# EAGLE design Swarmy_INS_Flight_Controller (EAGLE 9.6.2)
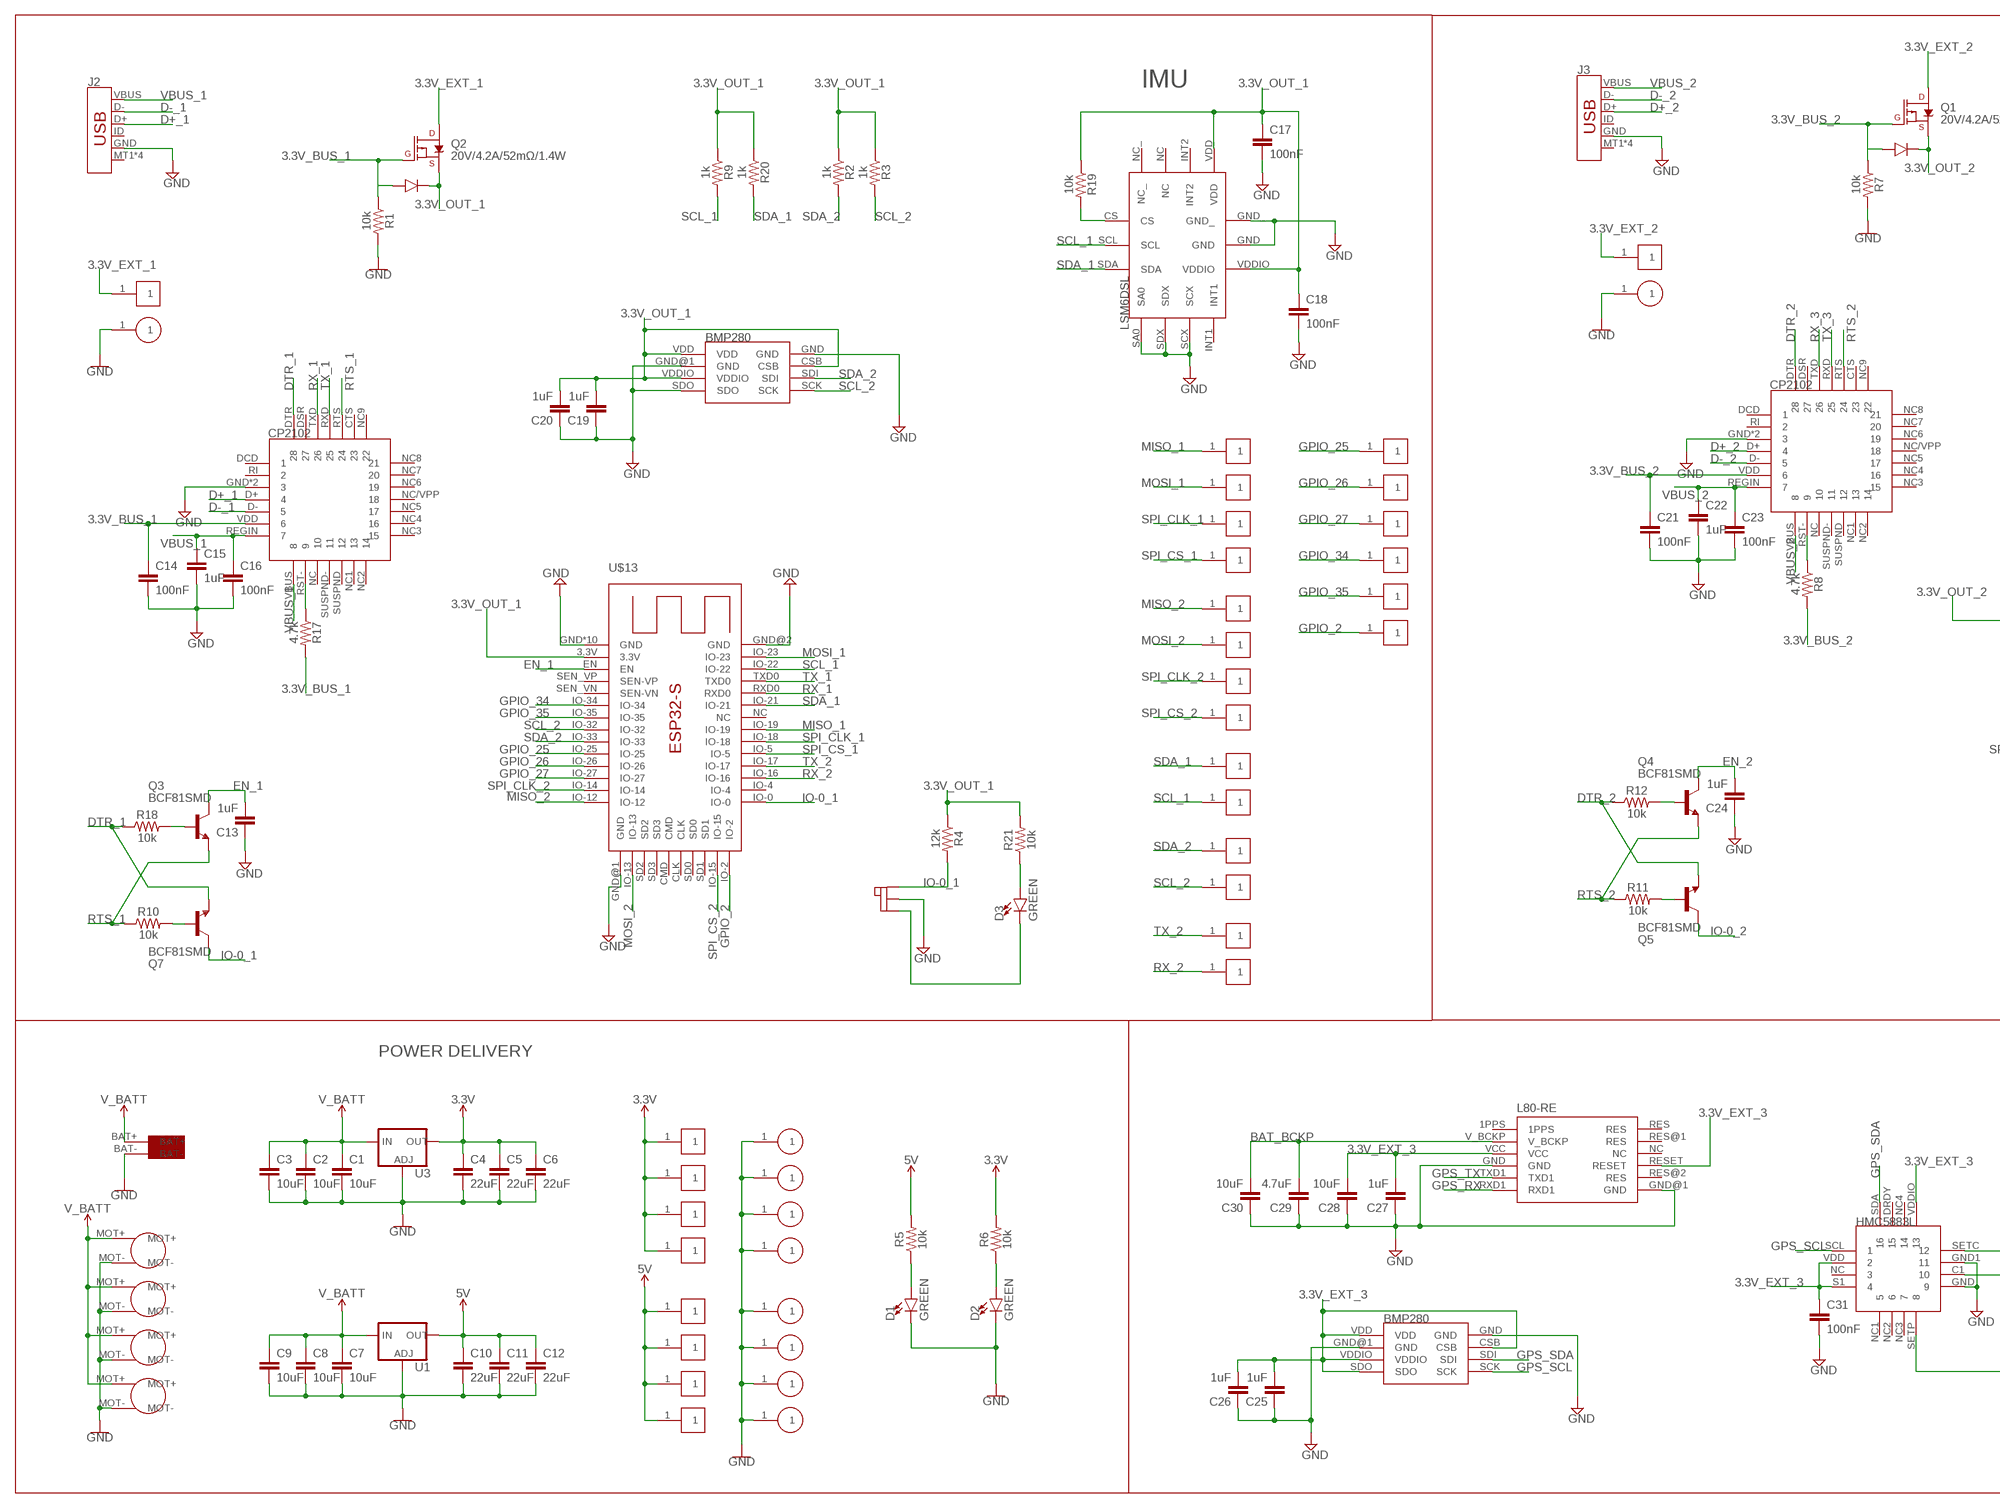
[diagram p0: schematic, sheet 1, part 1 of 2]
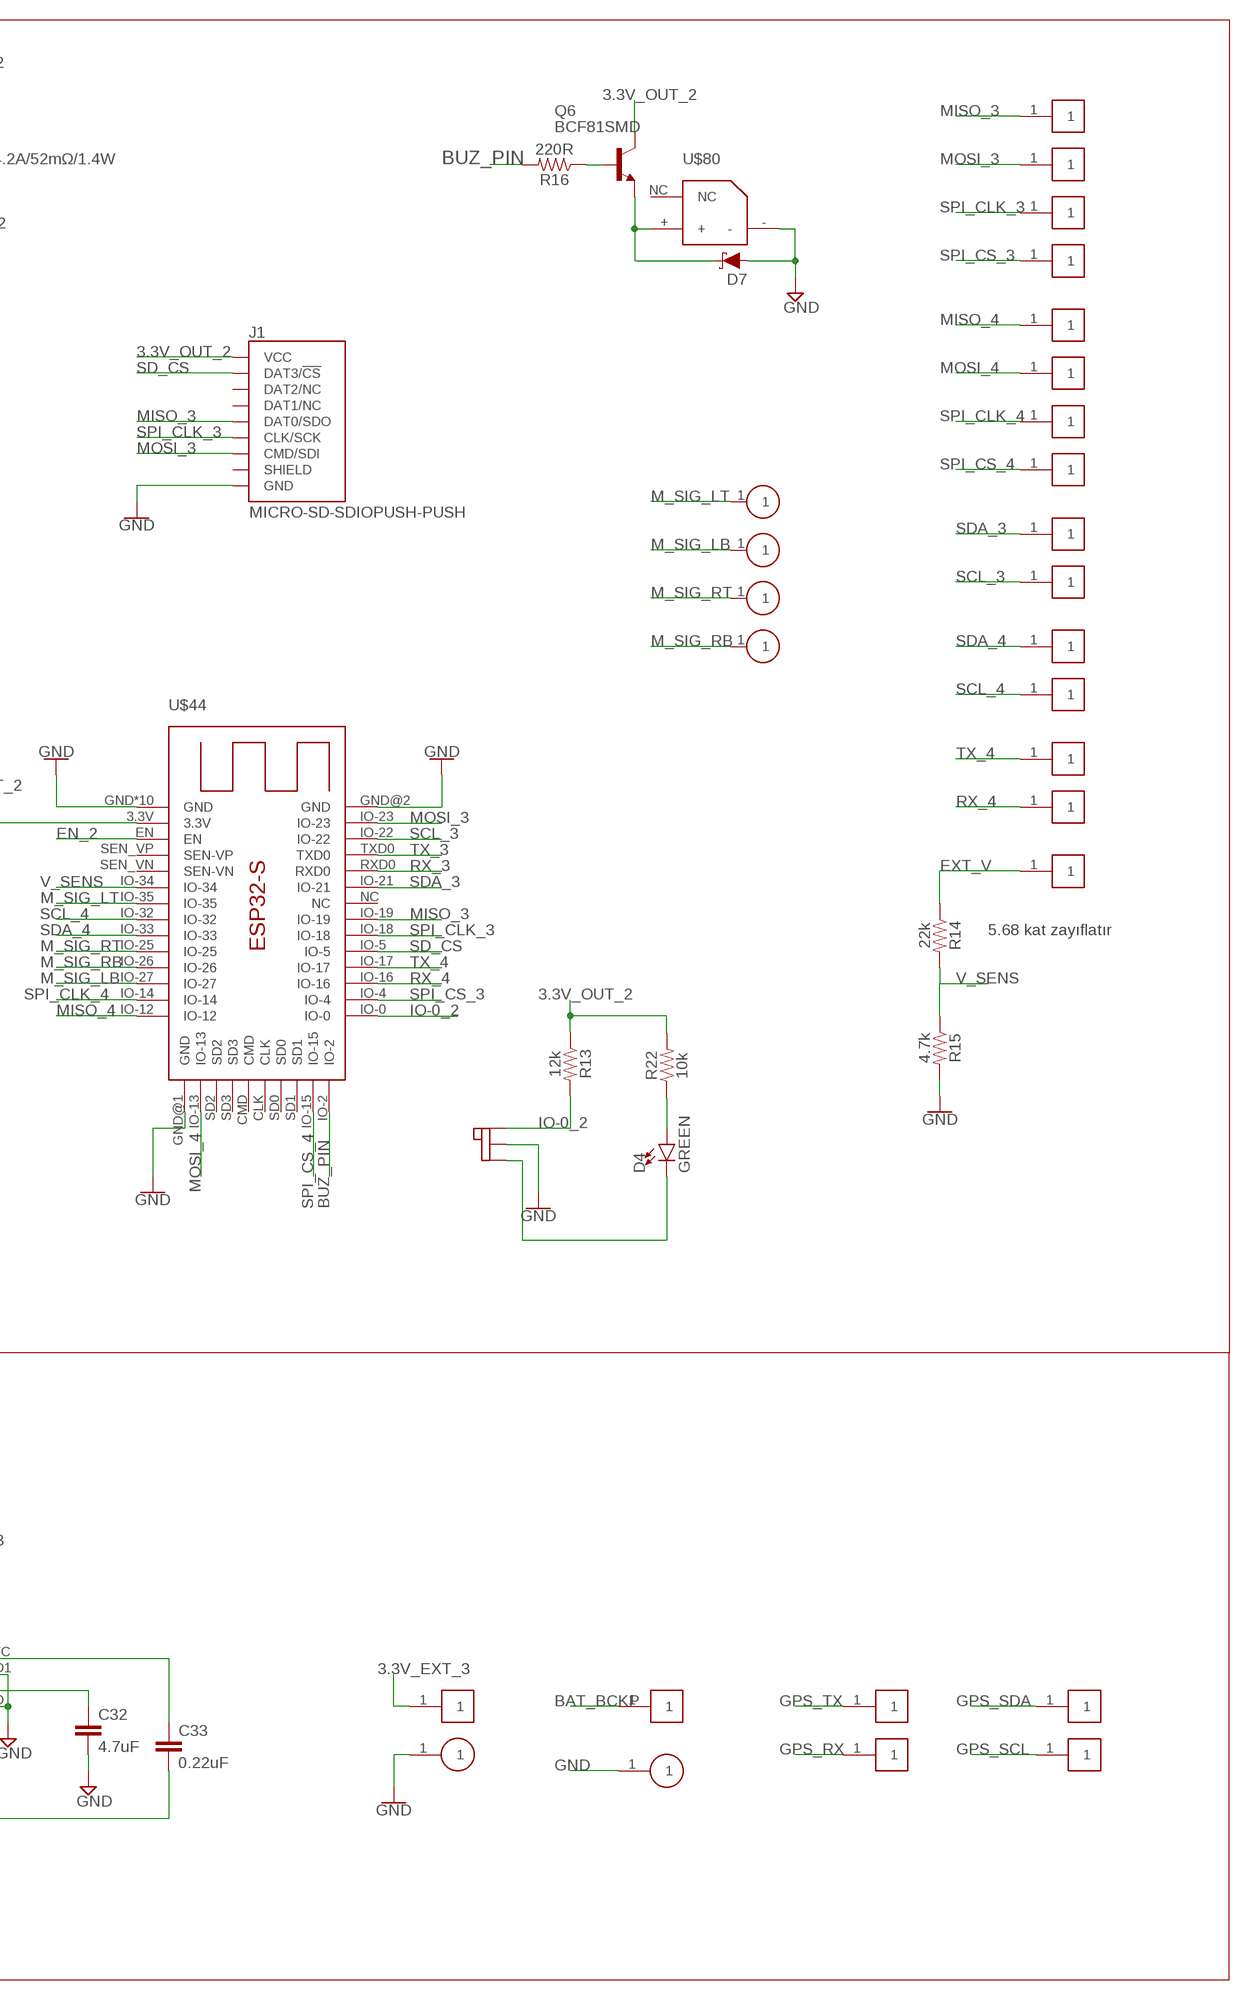
[diagram p1: schematic, sheet 1, part 2 of 2]

## Parts
C1  10uF  1.0PF-0603-50V-25%  [0603]
C2  10uF  1.0PF-0603-50V-25%  [0603]
C3  10uF  1.0PF-0603-50V-25%  [0603]
C4  22uF  1.0PF-0603-50V-25%  [0603]
C5  22uF  1.0PF-0603-50V-25%  [0603]
C6  22uF  1.0PF-0603-50V-25%  [0603]
C7  10uF  1.0PF-0603-50V-25%  [0603]
C8  10uF  1.0PF-0603-50V-25%  [0603]
C9  10uF  1.0PF-0603-50V-25%  [0603]
C10  22uF  1.0PF-0603-50V-25%  [0603]
C11  22uF  1.0PF-0603-50V-25%  [0603]
C12  22uF  1.0PF-0603-50V-25%  [0603]
C13  1uF  2.2UF-0603-10V-20%  [0603]
C14  100nF  2.2UF-0603-10V-20%  [0603]
C15  1uF  2.2UF-0603-10V-20%  [0603]
C16  100nF  2.2UF-0603-10V-20%  [0603]
C17  100nF  2.2UF-0603-10V-20%  [0603]
C18  100nF  2.2UF-0603-10V-20%  [0603]
C19  1uF  2.2UF-0603-10V-20%  [0603]
C20  1uF  2.2UF-0603-10V-20%  [0603]
C21  100nF  2.2UF-0603-10V-20%  [0603]
C22  1uF  2.2UF-0603-10V-20%  [0603]
C23  100nF  2.2UF-0603-10V-20%  [0603]
C24  1uF  2.2UF-0603-10V-20%  [0603]
C25  1uF  2.2UF-0603-10V-20%  [0603]
C26  1uF  2.2UF-0603-10V-20%  [0603]
C27  1uF  2.2UF-0603-10V-20%  [0603]
C28  10uF  2.2UF-0603-10V-20%  [0603]
C29  4.7uF  2.2UF-0603-10V-20%  [0603]
C30  10uF  2.2UF-0603-10V-20%  [0603]
C31  100nF  2.2UF-0603-10V-20%  [0603]
C32  4.7uF  2.2UF-0603-10V-20%  [0603]
C33  0.22uF  2.2UF-0603-10V-20%  [0603]
D1  GREEN  LED-GREEN0603  [LED-0603]
D2  GREEN  LED-GREEN0603  [LED-0603]
D3  GREEN  LED-GREEN0603  [LED-0603]
D4  GREEN  LED-GREEN0603  [LED-0603]
D7  120mA/40V/370mV  DIODE-SCHOTTKY-RB751S40  [SOD-523]
J1  MICRO-SD-SDIOPUSH-PUSH  [MICRO-SD-SOCKET]
J2  USB_MICRO-B_SMT  [USB-MICROB]
J3  USB_MICRO-B_SMT  [USB-MICROB]
Q1  20V/4.2A/52mΩ/1.4W  MOSFET_PCH-DMG2305UX-7  [SOT23-3]
Q2  20V/4.2A/52mΩ/1.4W  MOSFET_PCH-DMG2305UX-7  [SOT23-3]
Q3  BCF81SMD  [SOT23-BEC]
Q4  BCF81SMD  [SOT23-BEC]
Q5  BCF81SMD  [SOT23-BEC]
Q6  BCF81SMD  [SOT23-BEC]
Q7  BCF81SMD  [SOT23-BEC]
R1  10k  12KOHM-0603-1/10W-1%  [0603]
R2  1k  12KOHM-0603-1/10W-1%  [0603]
R3  1k  12KOHM-0603-1/10W-1%  [0603]
R4  12k  12KOHM-0603-1/10W-1%  [0603]
R5  10k  12KOHM-0603-1/10W-1%  [0603]
R6  10k  12KOHM-0603-1/10W-1%  [0603]
R7  10k  12KOHM-0603-1/10W-1%  [0603]
R8  4.7k  12KOHM-0603-1/10W-1%  [0603]
R9  1k  12KOHM-0603-1/10W-1%  [0603]
R10  10k  12KOHM-0603-1/10W-1%  [0603]
R11  10k  12KOHM-0603-1/10W-1%  [0603]
R12  10k  12KOHM-0603-1/10W-1%  [0603]
R13  12k  12KOHM-0603-1/10W-1%  [0603]
R14  22k  12KOHM-0603-1/10W-1%  [0603]
R15  4.7k  12KOHM-0603-1/10W-1%  [0603]
R16  220R  12KOHM-0603-1/10W-1%  [0603]
R17  4.7k  12KOHM-0603-1/10W-1%  [0603]
R18  10k  12KOHM-0603-1/10W-1%  [0603]
R19  10k  12KOHM-0603-1/10W-1%  [0603]
R20  1k  12KOHM-0603-1/10W-1%  [0603]
R21  10k  12KOHM-0603-1/10W-1%  [0603]
R22  10k  12KOHM-0603-1/10W-1%  [0603]
U1  V_REG_LM1117SOT223  [SOT223]
U3  V_REG_LM1117SOT223  [SOT223]
U$1  6X5MM_BATTERY_SOLDER_PADS  [6X5MM_BATTERY_SOLDER_PADS]
U$2  3X4.5MM_MOTOR_SOLDER_PADS  [3X4.5MM_MOTOR_SOLDER_PADS]
U$3  3X4.5MM_MOTOR_SOLDER_PADS  [3X4.5MM_MOTOR_SOLDER_PADS]
U$4  3X4.5MM_MOTOR_SOLDER_PADS  [3X4.5MM_MOTOR_SOLDER_PADS]
U$5  3X4.5MM_MOTOR_SOLDER_PADS  [3X4.5MM_MOTOR_SOLDER_PADS]
U$6  2X2MM_SQUARE_PAD  [2X2MM_SQUARE_PAD]
U$7  2X2MM_SQUARE_PAD  [2X2MM_SQUARE_PAD]
U$8  2X2MM_SQUARE_PAD  [2X2MM_SQUARE_PAD]
U$9  2X2MM_SQUARE_PAD  [2X2MM_SQUARE_PAD]
U$10  2X2MM_SQUARE_PAD  [2X2MM_SQUARE_PAD]
U$11  2X2MM_SQUARE_PAD  [2X2MM_SQUARE_PAD]
U$12  2X2MM_SQUARE_PAD  [2X2MM_SQUARE_PAD]
U$13  ESP32-S  [ESP32-S]
U$14  2X2MM_PAD  [2X2MM_PAD]
U$15  2X2MM_PAD  [2X2MM_PAD]
U$16  2X2MM_PAD  [2X2MM_PAD]
U$17  2X2MM_PAD  [2X2MM_PAD]
U$18  2X2MM_PAD  [2X2MM_PAD]
U$19  2X2MM_PAD  [2X2MM_PAD]
U$20  2X2MM_PAD  [2X2MM_PAD]
U$21  2X2MM_PAD  [2X2MM_PAD]
U$22  2X2MM_SQUARE_PAD  [2X2MM_SQUARE_PAD]
U$23  2X2MM_SQUARE_PAD  [2X2MM_SQUARE_PAD]
U$24  2X2MM_PAD  [2X2MM_PAD]
U$25  SOD_123_DIODE  [SOD_23_DIODE]
U$26  LSM6DSL_6DOF  [LSM6DSL_6DOF]
U$27  BMP280  [BMP280]
U$28  CP2102_SERIAL_TTL  [CP2102_SERIAL_TTL]
U$29  2X2MM_SQUARE_PAD  [2X2MM_SQUARE_PAD]
U$30  2X2MM_SQUARE_PAD  [2X2MM_SQUARE_PAD]
U$31  2X2MM_SQUARE_PAD  [2X2MM_SQUARE_PAD]
U$32  2X2MM_SQUARE_PAD  [2X2MM_SQUARE_PAD]
U$33  2X2MM_SQUARE_PAD  [2X2MM_SQUARE_PAD]
U$34  2X2MM_SQUARE_PAD  [2X2MM_SQUARE_PAD]
U$35  2X2MM_SQUARE_PAD  [2X2MM_SQUARE_PAD]
U$36  2X2MM_SQUARE_PAD  [2X2MM_SQUARE_PAD]
U$37  2X2MM_SQUARE_PAD  [2X2MM_SQUARE_PAD]
U$38  2X2MM_SQUARE_PAD  [2X2MM_SQUARE_PAD]
U$39  2X2MM_SQUARE_PAD  [2X2MM_SQUARE_PAD]
U$40  2X2MM_SQUARE_PAD  [2X2MM_SQUARE_PAD]
U$41  2X2MM_SQUARE_PAD  [2X2MM_SQUARE_PAD]
U$42  2X2MM_SQUARE_PAD  [2X2MM_SQUARE_PAD]
U$43  SMD_SLIDE_SWITCH  [SMD_SLIDE_SWITCH]
U$44  ESP32-S  [ESP32-S]
U$45  2X2MM_SQUARE_PAD  [2X2MM_SQUARE_PAD]
U$46  2X2MM_PAD  [2X2MM_PAD]
U$47  SOD_123_DIODE  [SOD_23_DIODE]
U$48  CP2102_SERIAL_TTL  [CP2102_SERIAL_TTL]
U$49  SMD_SLIDE_SWITCH  [SMD_SLIDE_SWITCH]
U$50  2X2MM_SQUARE_PAD  [2X2MM_SQUARE_PAD]
U$51  2X2MM_SQUARE_PAD  [2X2MM_SQUARE_PAD]
U$52  2X2MM_SQUARE_PAD  [2X2MM_SQUARE_PAD]
U$53  2X2MM_SQUARE_PAD  [2X2MM_SQUARE_PAD]
U$54  2X2MM_SQUARE_PAD  [2X2MM_SQUARE_PAD]
U$55  2X2MM_SQUARE_PAD  [2X2MM_SQUARE_PAD]
U$56  2X2MM_SQUARE_PAD  [2X2MM_SQUARE_PAD]
U$57  2X2MM_SQUARE_PAD  [2X2MM_SQUARE_PAD]
U$58  2X2MM_SQUARE_PAD  [2X2MM_SQUARE_PAD]
U$59  2X2MM_SQUARE_PAD  [2X2MM_SQUARE_PAD]
U$60  2X2MM_SQUARE_PAD  [2X2MM_SQUARE_PAD]
U$61  2X2MM_SQUARE_PAD  [2X2MM_SQUARE_PAD]
U$62  2X2MM_SQUARE_PAD  [2X2MM_SQUARE_PAD]
U$63  2X2MM_SQUARE_PAD  [2X2MM_SQUARE_PAD]
U$64  L80-RE-M37  [L80-RE-M37]
U$65  2X2MM_SQUARE_PAD  [2X2MM_SQUARE_PAD]
U$66  BMP280  [BMP280]
U$67  2X2MM_SQUARE_PAD  [2X2MM_SQUARE_PAD]
U$68  2X2MM_PAD  [2X2MM_PAD]
U$69  2X2MM_SQUARE_PAD  [2X2MM_SQUARE_PAD]
U$70  2X2MM_PAD  [2X2MM_PAD]
U$71  2X2MM_SQUARE_PAD  [2X2MM_SQUARE_PAD]
U$72  2X2MM_SQUARE_PAD  [2X2MM_SQUARE_PAD]
U$73  2X2MM_SQUARE_PAD  [2X2MM_SQUARE_PAD]
U$74  2X2MM_SQUARE_PAD  [2X2MM_SQUARE_PAD]
U$75  HMC5883L  [HMC5883L]
U$76  2X2MM_ROUND_PAD  [2X2MM_ROUND_PAD]
U$77  2X2MM_ROUND_PAD  [2X2MM_ROUND_PAD]
U$78  2X2MM_ROUND_PAD  [2X2MM_ROUND_PAD]
U$79  2X2MM_ROUND_PAD  [2X2MM_ROUND_PAD]
U$80  PASIVE_BUZZER_5MM_X_5MM_20MM  [PASIVE_BUZZER_5MM_X_5MM_20MM]
U$81  2X2MM_SQUARE_PAD  [2X2MM_SQUARE_PAD]
U$82  2X2MM_SQUARE_PAD  [2X2MM_SQUARE_PAD]
U$83  2X2MM_SQUARE_PAD  [2X2MM_SQUARE_PAD]
U$84  2X2MM_SQUARE_PAD  [2X2MM_SQUARE_PAD]
U$85  2X2MM_SQUARE_PAD  [2X2MM_SQUARE_PAD]
U$86  2X2MM_SQUARE_PAD  [2X2MM_SQUARE_PAD]

## Nets
3.3V: C4.1 C5.1 C6.1 R6.2 U3.2(OUT) U3.4(OUT) U$6.1 U$7.1 U$8.1 U$22.1
3.3V_BUS_1: C14.1 Q2.1(G) R1.1 R17.2 U$25.A U$28.VDD
3.3V_BUS_2: C21.1 Q1.1(G) R7.1 R8.2 U$47.A U$48.VDD
3.3V_EXT_1: Q2.3(D) U$23.1
3.3V_EXT_2: Q1.3(D) U$45.1
3.3V_EXT_3: C25.2 C26.2 C27.2 C28.2 C31.1 U$64.RESET U$64.VCC U$66.CSB U$66.SDO U$66.VDD U$66.VDDIO U$67.1 U$75.S1 U$75.VDD U$75.VDDIO
3.3V_OUT_1: C17.1 C18.1 C19.2 C20.2 Q2.2(S) R2.1 R3.1 R4.1 R9.1 R19.1 R20.1 R21.2 U$13.3.3V U$25.K U$26.VDD U$26.VDDIO U$27.CSB U$27.VDD U$27.VDDIO
3.3V_OUT_2: J1.VCC Q1.2(S) Q6.C R13.1 R22.2 U$44.3.3V U$47.K
5V: C10.1 C11.1 C12.1 R5.2 U1.2(OUT) U1.4(OUT) U$9.1 U$10.1 U$11.1 U$12.1
BAT_BCKP: C29.2 C30.2 U$64.V_BCKP U$69.1
BUZ_PIN: R16.2 U$44.IO-2
D+_1: J2.D+ U$28.D+
D+_2: J3.D+ U$48.D+
D-_1: J2.D- U$28.D-
D-_2: J3.D- U$48.D-
DTR_1: Q7.E R18.1 U$28.DTR
DTR_2: Q5.E R12.1 U$48.DTR
EN_1: C13.2 Q3.C U$13.EN
EN_2: C24.2 Q4.C U$44.EN
EXT_V: R14.1 U$65.1
GND: C1.2 C2.2 C3.2 C4.2 C5.2 C6.2 C7.2 C8.2 C9.2 C10.2 C11.2 C12.2 C13.1 C14.2 C15.2 C16.2 C17.2 C18.2 C19.1 C20.1 C21.2 C22.2 C23.2 C24.1 C25.1 C26.1 C27.1 C28.1 C29.1 C30.1 C31.2 C32.2 D1.C D2.C D7.A J1.GND J1.GND1(GND) J1.GND3(GND) J2.GND J3.GND R1.2 R7.2 R15.2 U1.1(ADJ) U3.1(ADJ) U$1.BAT- U$2.MOT- U$3.MOT- U$4.MOT- U$5.MOT- U$13.GND U$13.GND@1(GND) U$13.GND@2(GND) U$13.GND@3(GND) U$13.GND@4(GND) U$13.GND@5(GND) U$13.GND@6(GND) U$13.GND@7(GND) U$13.GND@8(GND) U$13.GND@9(GND) U$13.GND@10(GND) U$13.GND@11(GND) U$14.1 U$15.1 U$16.1 U$17.1 U$18.1 U$19.1 U$20.1 U$21.1 U$24.1 U$26.GND U$26.GND_ U$26.SA0 U$26.SCX U$26.SDX U$27.GND U$27.GND@1(GND) U$27.SDO U$28.GND U$28.GND1 U$43.2 U$44.GND U$44.GND@1(GND) U$44.GND@2(GND) U$44.GND@3(GND) U$44.GND@4(GND) U$44.GND@5(GND) U$44.GND@6(GND) U$44.GND@7(GND) U$44.GND@8(GND) U$44.GND@9(GND) U$44.GND@10(GND) U$44.GND@11(GND) U$46.1 U$48.GND U$48.GND1 U$49.2 U$64.GND U$64.GND@1(GND) U$66.GND U$66.GND@1(GND) U$68.1 U$70.1 U$75.GND U$75.GND1 U$80.-
GPIO_2: U$13.IO-2 U$86.1
GPIO_25: U$13.IO-25 U$81.1
GPIO_26: U$13.IO-26 U$82.1
GPIO_27: U$13.IO-27 U$83.1
GPIO_34: U$13.IO-34 U$84.1
GPIO_35: U$13.IO-35 U$85.1
GPS_RX: U$64.RXD1 U$72.1
GPS_SCL: U$66.SCK U$74.1 U$75.SCL
GPS_SDA: U$66.SDI U$73.1 U$75.SDA
GPS_TX: U$64.TXD1 U$71.1
IO-0_1: Q7.C R4.2 U$13.IO-0 U$43.3
IO-0_2: Q5.C R13.2 U$44.IO-0 U$49.3
M_SIG_LB: U$44.IO-27 U$77.1
M_SIG_LT: U$44.IO-35 U$76.1
M_SIG_RB: U$44.IO-26 U$79.1
M_SIG_RT: U$44.IO-25 U$78.1
MISO_1: U$13.IO-19 U$29.1
MISO_2: U$13.IO-12 U$33.1
MISO_3: J1.DO/DAT0(DAT0/SDO) U$44.IO-19 U$50.1
MISO_4: U$44.IO-12 U$54.1
MOSI_1: U$13.IO-23 U$30.1
MOSI_2: U$13.IO-13 U$34.1
MOSI_3: J1.DI/CMD(CMD/SDI) U$44.IO-23 U$51.1
MOSI_4: U$44.IO-13 U$55.1
N$1: D1.A R5.1
N$2: D2.A R6.1
N$3: R8.1 U$48.RST-
N$4: Q5.B R11.2
N$5: Q4.B R12.2
N$6: D3.A R21.1
N$7: D4.A R22.1
N$8: D3.C U$43.1
N$9: D4.C U$49.1
N$10: Q6.B R16.1
N$11: R17.1 U$28.RST-
N$12: D7.C Q6.E U$80.+
N$13: Q3.B R18.2
N$15: R19.2 U$26.CS
N$17: Q7.B R10.2
N$22: C33.2 U$75.SETP
N$26: C32.1 U$75.C1
N$27: C33.1 U$75.SETC
RTS_1: Q3.E R10.1 U$28.RTS
RTS_2: Q4.E R11.1 U$48.RTS
RX_1: U$13.RXD0 U$28.TXD
RX_2: U$13.IO-16 U$42.1
RX_3: U$44.RXD0 U$48.TXD
RX_4: U$44.IO-16 U$63.1
SCL_1: R9.2 U$13.IO-22 U$26.SCL U$38.1
SCL_2: R3.2 U$13.IO-32 U$27.SCK U$40.1
SCL_3: U$44.IO-22 U$59.1
SCL_4: U$44.IO-32 U$61.1
SD_CS: J1.CS/DAT3(DAT3/!CS!) U$44.IO-5
SDA_1: R20.2 U$13.IO-21 U$26.SDA U$37.1
SDA_2: R2.2 U$13.IO-33 U$27.SDI U$39.1
SDA_3: U$44.IO-21 U$58.1
SDA_4: U$44.IO-33 U$60.1
SPI_CLK_1: U$13.IO-18 U$31.1
SPI_CLK_2: U$13.IO-14 U$35.1
SPI_CLK_3: J1.SCLK(CLK/SCK) U$44.IO-18 U$52.1
SPI_CLK_4: U$44.IO-14 U$56.1
SPI_CS_1: U$13.IO-5 U$32.1
SPI_CS_2: U$13.IO-15 U$36.1
SPI_CS_3: U$44.IO-4 U$53.1
SPI_CS_4: U$44.IO-15 U$57.1
TX_1: U$13.TXD0 U$28.RXD
TX_2: U$13.IO-17 U$41.1
TX_3: U$44.TXD0 U$48.RXD
TX_4: U$44.IO-17 U$62.1
V_BATT: C1.1 C2.1 C3.1 C7.1 C8.1 C9.1 U1.3(IN) U3.3(IN) U$1.BAT+ U$2.MOT+ U$3.MOT+ U$4.MOT+ U$5.MOT+
V_SENS: R14.2 R15.1 U$44.IO-34
VBUS_1: C15.1 C16.1 J2.VBUS U$28.REGIN U$28.VBUS
VBUS_2: C22.1 C23.1 J3.VBUS U$48.REGIN U$48.VBUS
Unconnected: J1.CD1(SHIELD) J1.DAT1(DAT1/NC) J1.DAT2(DAT2/NC) J2.ID J2.MT1(SHIELD) J2.MT2(SHIELD) J2.P$1(SHIELD) J2.P$2(SHIELD) J3.ID J3.MT1(SHIELD) J3.MT2(SHIELD) J3.P$1(SHIELD) J3.P$2(SHIELD) U$13.CLK U$13.CMD U$13.IO-4 U$13.NC U$13.SD0 U$13.SD1 U$13.SD2 U$13.SD3 U$13.SEN_VN(SEN-VN) U$13.SEN_VP(SEN-VP) U$26.INT1 U$26.INT2 U$26.NC U$26.NC_ U$28.CTS U$28.DCD U$28.DSR U$28.NC U$28.NC1 U$28.NC2 U$28.NC3 U$28.NC4 U$28.NC5 U$28.NC6 U$28.NC7 U$28.NC8 U$28.NC9 U$28.NC/VPP U$28.RI U$28.SUSPND U$28.SUSPND- U$44.CLK U$44.CMD U$44.NC U$44.SD0 U$44.SD1 U$44.SD2 U$44.SD3 U$44.SEN_VN(SEN-VN) U$44.SEN_VP(SEN-VP) U$48.CTS U$48.DCD U$48.DSR U$48.NC U$48.NC1 U$48.NC2 U$48.NC3 U$48.NC4 U$48.NC5 U$48.NC6 U$48.NC7 U$48.NC8 U$48.NC9 U$48.NC/VPP U$48.RI U$48.SUSPND U$48.SUSPND- U$64.1PPS U$64.NC U$64.RES U$64.RES@1(RES) U$64.RES@2(RES) U$75.DRDY U$75.NC U$75.NC1 U$75.NC2 U$75.NC3 U$75.NC4 U$80.NC

## Notes on the sheet
- IMU
- 5.68 kat zayıflatır
- POWER DELIVERY

## Library data of the parts
C1-C12 = SparkFun-Capacitors:1.0PF: 1pF ceramic capacitors A capacitor is a passive two-terminal electrical component used to store electrical energy temporarily in an electric field.; PROD_ID: CAP-07879; VALUE: 1.0pF
C13-C33 = SparkFun-Capacitors:2.2UF: 2.2µF ceramic capacitors A capacitor is a passive two-terminal electrical component used to store electrical energy temporarily in an electric field.; PROD_ID: CAP-07888; VALUE: 2.2uF
D1-D4 = SparkFun-LED:LED-GREEN: Green SMD LED Used in manufacturing of various products at SparkFun Packages: 0603 - SMD 0603 package [Product Link] <http://www.futureelectronics.com/en/technologies/semiconductors/optoelectronics/leds/Pages/9894312-LTST-C190GKT.aspx?CrossPart=HSMG-C190&IM=0> LilyPad 1206 - SMD1206 LilyPad package [Product Link] <http://www.futureelectronics.com/en/Technologies/Product.aspx?ProductID=IN150NGHARVATEKCORPORATION2049943&IM=0> 1206 - SMD1206 package [Product Link] <http://www.futureelectronics.com/en/technologies/semiconductors/optoelectronics/leds/Pages/8315665-LTST-C150KGKT.aspx?IM=0> 1206 Bottom Mount -SMD 1206 Bottom Mount [Product Link] <http://www.digikey.com/product-detail/en/lite-on-inc/LTST-C230KGKT/160-1456-1-ND/386854> SparkFun Products: Pro Mini 328 -5V <https://www.sparkfun.com/products/821> RedBoard <https://www.sparkfun.com/products/12757> MP3 Trigger <https://www.sparkfun.com/products/13720> Makey Makey <https://www.sparkfun.com/products/11076>; PROD_ID: DIO-00821
D7 = SparkFun-DiscreteSemi:DIODE-SCHOTTKY: Schottky diode A Schottky diode is a semiconductor diode which has a low forward voltage drop and a very fast switching action.; PROD_ID: DIO-11018
J1 = SparkFun-Connectors:MICRO-SD-SDIO: microSD Socket for Transflash Push-push type µSD socket. tDoc lines correctly indicate media card edge positions when inserting (unlocked, locked, depressed). NOTE: CD1 and CD2 are connected internally, and the default detect state of the socket is detect pin to ground. SparkFun Products: WAV Trigger <https://www.sparkfun.com/products/13660> CAN-Bus Shield <https://www.sparkfun.com/products/13262> SparkFun Level Shifing microSD Breakout <https://www.sparkfun.com/products/13743>; PROD_ID: CONN-07820
J2 J3 = SparkFun-Connectors:USB_MICRO-B: USB Type Micro-B Connector Male/female and PTH/SMT variants SparkFun Products: SparkFun microB USB Breakout <https://www.sparkfun.com/products/12035> SparkFun USB microB Plug Breakout <https://www.sparkfun.com/products/10031> SparkFun ESP8266 Thing <https://www.sparkfun.com/products/13231>; PROD_ID: CONN-09505; SF_ID: PRT-08533
Q1 Q2 = SparkFun-DiscreteSemi:MOSFET_PCH: P-channel MOSFETs Voltage controlled devices that allow control of high current outputs. SparkFun Products: SparkFun ESP32 Thing <https://www.sparkfun.com/products/13907> SparkFun ESP8266 Thing <https://www.sparkfun.com/products/13231> SparkFun Pi Servo HAT V2 <https://www.sparkfun.com/products/15316> DMG2305UX-7 (20V/4.2A/SOT23-3); PROD_ID: TRAN-14388
Q3-Q7 = transistor-npn:BCF81*: NPN Transistor
R1-R3 R5-R12 R14-R22 = SparkFun-Resistors:12KOHM: 12kΩ resistor A resistor is a passive two-terminal electrical component that implements electrical resistance as a circuit element. Resistors act to reduce current flow, and, at the same time, act to lower voltage levels within circuits. - Wikipedia; PROD_ID: RES-10327; VALUE: 12k
R4 R13 = SparkFun-Resistors:12KOHM: 12kΩ resistor A resistor is a passive two-terminal electrical component that implements electrical resistance as a circuit element. Resistors act to reduce current flow, and, at the same time, act to lower voltage levels within circuits. - Wikipedia; PROD_ID: RES-10327
U1 U3 = SparkFun-IC-Power:V_REG_LM1117: Voltage Regulator LM1117 Standard adjustable voltage regulator but in SMD form. Spark Fun Electronics SKU : COM-00595; PROD_ID: VREG-08170
U$1 = 6x5mm_Battery_Solder_pads:6X5MM_BATTERY_SOLDER_PADS
U$2-U$5 = 3x4.5mm_Motor_solder_pads:3X4.5MM_MOTOR_SOLDER_PADS
U$6-U$12 U$22 U$23 U$45 U$67 U$69 = 2x2mm_square_pad:2X2MM_SQUARE_PAD
U$13 U$44 = ESP32-S:ESP32-S: ESP32-S WIFI/BLUETOOTH MICRO CONTROLLER IC size 18mm x 25.5mm pad size 1.5mm x 0.9mm
U$14-U$21 U$24 U$46 U$68 U$70 = 2x2mm_pad:2X2MM_PAD
U$25 U$47 = SOD_123_Diode:SOD_123_DIODE
U$26 = LSM6DLS:LSM6DSL_6DOF
U$27 U$66 = BMP280_Chip:BMP280
U$28 U$48 = CP2102_SERIAL_TTLlbr:CP2102_SERIAL_TTL
U$29-U$42 U$50-U$63 U$65 U$71-U$74 U$81-U$86 = 2x2mm_square_pad_SM:2X2MM_SQUARE_PAD
U$43 U$49 = SMD_Slide_Switch:SMD_SLIDE_SWITCH
U$64 = L80-RE_GPS:L80-RE-M37
U$75 = HMC5883L:HMC5883L
U$76-U$79 = 2X2MM_ROUND_PAD:2X2MM_ROUND_PAD
U$80 = PASIVE_BUZZER_5MM_X_5MM_20MM:PASIVE_BUZZER_5MM_X_5MM_20MM: PASIVE_BUZZER_5MM_X_5MM_20MM

## Board
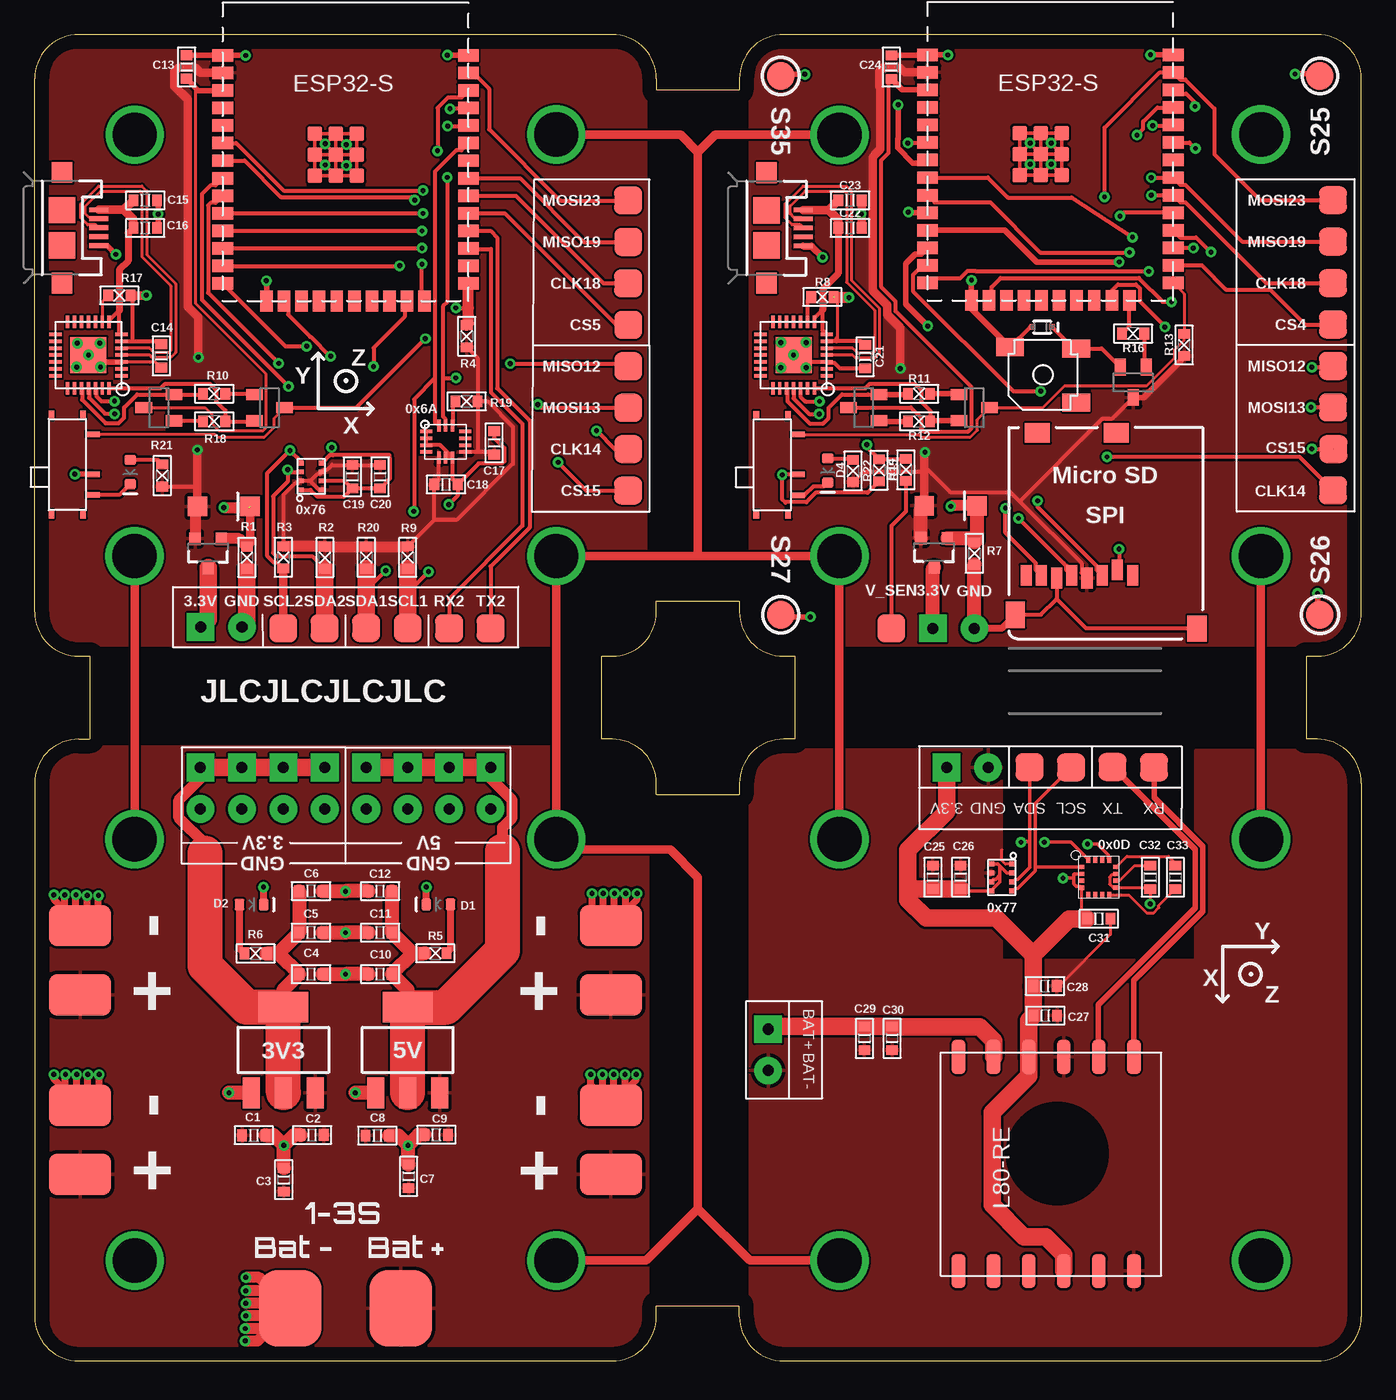
[diagram p2: board, top side]
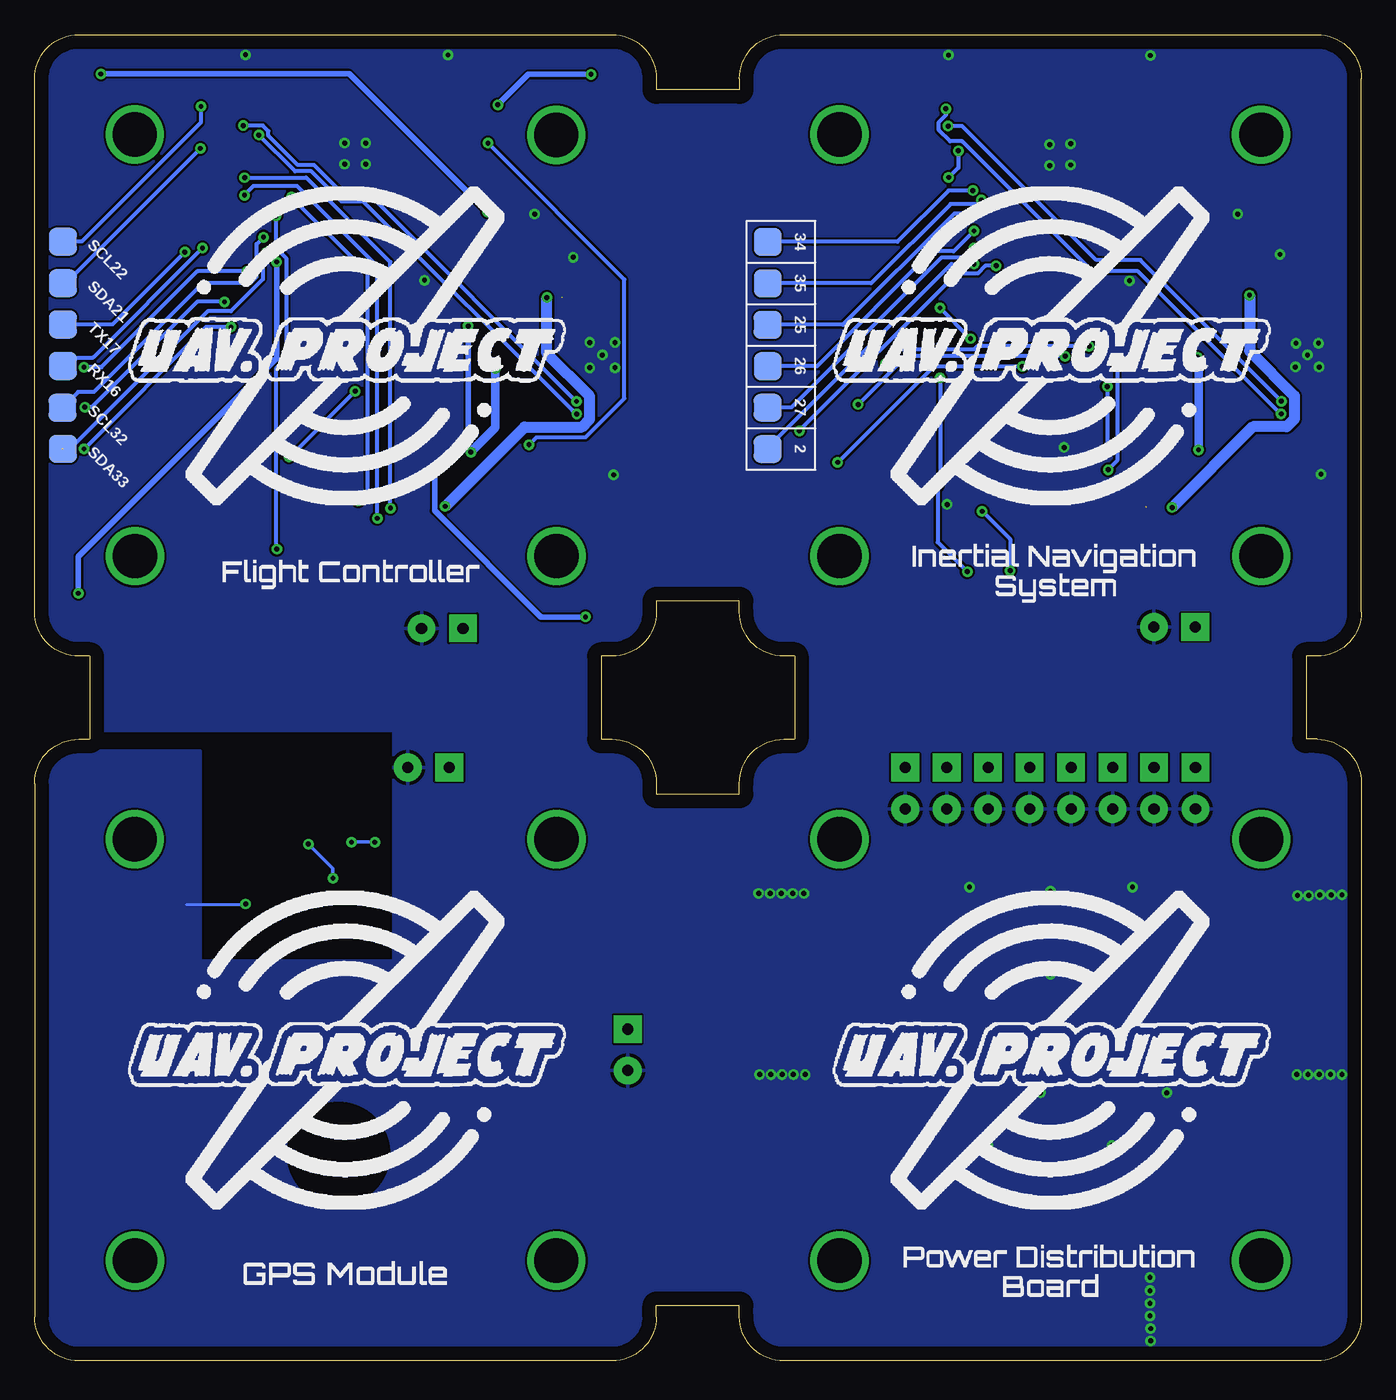
[diagram p3: board, bottom side, seen from below]

Size 96 x 96 mm. Coordinates in mm from the lower left corner, seen from the top.
Outline: 45,54.2 45,55 51,55 51,54.2 arc90 54.2,51 55,51 55,45 54.2,45 arc90 51,41.8 51,41 45,41 45,41.8 arc90 41.8,45 41,45 41,51 41.8,51 arc90 45,54.2
Outline: 92,51 92.8,51 arc90 96,54.2 96,92.8 arc90 92.8,96 54.2,96 arc90 51,92.8 51,92 45,92 45,92.8 arc90 41.8,96 3.2,96 arc90 0,92.8 0,54.2 arc90 3.2,51 4,51 4,45 3.2,45 arc90 0,41.8 0,3.2 arc90 3.2,0 41.8,0 arc90 45,3.2 45,4 51,4 51,3.2 arc90 54.2,0 92.8,0 arc90 96,3.2 96,41.8 arc90 92.8,45 92,45 92,51
Copper layers (1*16): Top 0.035mm / dielectric 1.5mm / Bottom 0.035mm
Design rules "default *": minimum track width 6mil, minimum drill 0.35mm, track to track 6mil, track to pad 6mil, pad to pad 6mil, via to via 6mil, smd to smd 6mil, copper to edge 40mil, drill to drill 6mil, minimum pad ring 10mil, minimum via ring 8mil, stop-mask expansion 4mil, vias tented up to drill 14mil, thermal gap 10mil
tRestrict: area 70.3,11.3 to 77.7,18.7
bRestrict: area 70.3,11.3 to 77.7,18.7

### Footprints (pad centres in the part's own frame; a part is rotated, then mirrored left to right if it is on the bottom)
0603 = smd 0.7 x 0.85: 1 -0.85,0; 2 0.85,0
LED-0603 = smd 0.7 x 0.85: A -0.877,0; C 0.877,0
SOD-523 = smd 0.4 x 0.4: A -0.7,0; C 0.7,0
MICRO-SD-SOCKET = smd 1.8 x 1.4: CD1 -2.05,0.4; CD2 -7.75,0.4 | smd 0.8 x 1.5: CS/DAT3 -7.84,10.3; DAT1 -1.24,10.7; DAT2 -8.94,10.7; DI/CMD -6.74,10.7; DO/DAT0 -2.34,10.7; GND -3.44,10.9; SCLK -4.54,10.7; VCC -5.64,10.9 | smd 1.4 x 1.9: GND1 -13.6,14.55; GND3 -0.45,13.55
USB-MICROB = smd 1.4 x 0.35: D+ -2.65,0; D- -2.65,-0.65; GND -2.65,1.3; ID -2.65,0.65; VBUS -2.65,-1.3 | smd 1.5 x 1.5: MT1 0,-4; MT2 0,4 | smd 1.9 x 1.9: P$1 0,-1.27; P$2 0,1.27
SOT23-3 = smd 0.8 x 0.9: 1 -0.95,-1; 2 0.95,-1; 3 0,1.1
SOT23-BEC = smd 0.8 x 1.2: B -0.95,-1.1; C 0,1.1; E 0.95,-1.1
0603' = smd 0.7 x 0.85: 1 -0.8,0; 2 0.8,0
SOT223 = smd 1.219 x 2.235: 1 -2.311,-3.099; 2 0,-3.099; 3 2.311,-3.099 | smd 3.6 x 2.2: 4 0,3.099
6X5MM_BATTERY_SOLDER_PADS = smd 4.5 x 5.5: BAT+ 4,0; BAT- -4,0
3X4.5MM_MOTOR_SOLDER_PADS = smd 3 x 4.5: MOT+ -2.5,0; MOT- 2.5,0
2X2MM_SQUARE_PAD = drill 0.8 pad 2 square: 1 0,0
ESP32-S = smd 1.5 x 0.9: 3.3V -8.89,7.62; EN -8.89,6.35; GND -8.89,8.89; GND@2 8.89,8.89; IO-0 8.89,-7.62; IO-4 8.89,-6.35; IO-5 8.89,-2.54; IO-12 -8.89,-7.62; IO-14 -8.89,-6.35; IO-16 8.89,-5.08; IO-17 8.89,-3.81; IO-18 8.89,-1.27; IO-19 8.89,0; IO-21 8.89,2.54; IO-22 8.89,6.35; IO-23 8.89,7.62; IO-25 -8.89,-2.54; IO-26 -8.89,-3.81; IO-27 -8.89,-5.08; IO-32 -8.89,0; IO-33 -8.89,-1.27; IO-34 -8.89,2.54; IO-35 -8.89,1.27; NC 8.89,1.27; RXD0 8.89,3.81; SEN_VN -8.89,3.81; SEN_VP -8.89,5.08; TXD0 8.89,5.08 | smd 0.9 x 1.5: CLK 0.635,-8.89; CMD -0.635,-8.89; GND@1 -5.715,-8.89; IO-2 5.715,-8.89; IO-13 -4.445,-8.89; IO-15 4.445,-8.89; SD0 1.905,-8.89; SD1 3.175,-8.89; SD2 -3.175,-8.89; SD3 -1.905,-8.89 | smd 1.05 x 1.05: GND@3 -2.225,3.225; GND@4 -0.7,3.225; GND@5 0.825,3.225; GND@6 -2.225,1.7; GND@7 -0.7,1.7; GND@8 0.825,1.7; GND@9 -2.225,0.175; GND@10 -0.7,0.175; GND@11 0.825,0.175
2X2MM_PAD = drill 0.8 pad 2: 1 0,0
SOD_23_DIODE = smd 1.4 x 1.4: A 1.9,0; K -1.9,0
LSM6DSL_6DOF = smd 0.25 x 0.875: CS 0.5,1.2; GND 0,-1.1; GND_ 0.5,-1.1; SCL 0,1.2; SDA -0.5,1.2; VDDIO -0.5,-1.1 | smd 0.875 x 0.25: INT1 -1.4,-0.7; INT2 1.4,-0.2; NC 1.4,0.3; NC_ 1.4,0.8; SA0 -1.4,0.8; SCX -1.4,-0.2; VDD 1.4,-0.7 | smd 0.876 x 0.25: SDX -1.4,0.3
BMP280 = smd 0.5 x 0.35: CSB 0.774,0.308; GND 0.774,0.958; GND@1 -0.816,0.308; SCK 0.774,-0.992; SDI 0.774,-0.342; SDO -0.816,-0.992; VDD -0.816,0.958; VDDIO -0.816,-0.342
CP2102_SERIAL_TTL = smd 0.25 x 0.9: CTS 1,2.4; DSR -1,2.4; DTR -1.5,2.4; NC -0.5,-2.4; NC1 1,-2.4; NC2 1.5,-2.4; NC9 1.5,2.4; RST- -1,-2.4; RTS 0.5,2.4; RXD 0,2.4; SUSPND 0.5,-2.4; SUSPND- 0,-2.4; TXD -0.5,2.4; VBUS -1.5,-2.4 | smd 0.9 x 0.25: D+ -2.4,0; D- -2.4,-0.5; DCD -2.4,1.5; GND -2.4,0.5; NC3 2.4,-1.5; NC4 2.4,-1; NC5 2.4,-0.5; NC6 2.4,0.5; NC7 2.4,1; NC8 2.4,1.5; NC/VPP 2.4,0; REGIN -2.4,-1.5; RI -2.4,1; VDD -2.4,-1 | smd 2.6 x 2.6: GND1 0,0
2X2MM_SQUARE_PAD' = smd 2 x 2: 1 0,0
SMD_SLIDE_SWITCH = smd 1 x 0.4: 1 1.8,-2.2; 2 1.8,-0.7; 3 1.8,2.2 | smd 0.4 x 0.6: P$4 1.1,-3.6; P$5 -1.2,-3.6; P$6 -1.2,3.6; P$7 1.1,3.6
L80-RE-M37 = smd 2.5 x 1: 1PPS 0,12.7; GND 0,5.08; GND@1 -15.5,0; NC -15.5,7.62; RES -15.5,12.7; RES@1 -15.5,10.16; RES@2 -15.5,2.54; RESET -15.5,5.08; RXD1 0,0; TXD1 0,2.54; V_BCKP 0,10.16; VCC 0,7.62
HMC5883L = smd 0.45 x 0.3: C1 1.27,-0.25; GND 1.27,-0.75; GND1 1.27,0.25; NC -1.27,-0.25; S1 -1.27,-0.75; SCL -1.27,0.75; SETC 1.27,0.75; VDD -1.27,0.25 | smd 0.3 x 0.45: DRDY -0.25,1.28; NC1 -0.75,-1.28; NC2 -0.25,-1.28; NC3 0.25,-1.28; NC4 0.25,1.28; SDA -0.75,1.28; SETP 0.75,-1.28; VDDIO 0.75,1.28
2X2MM_ROUND_PAD = smd 2 x 2: 1 0,0
PASIVE_BUZZER_5MM_X_5MM_20MM = smd 2 x 1.3: + -2.4,-1.9; - 2.4,-2; NC -2.4,2

### Placement (x,y rotation side)
C1  15.87,16.32 0 top
C2  20.08,16.35 180 top
C3  18.03,13.11 90 top
C4  20,27.99 0 top
C5  20,31 0 top
C6  20,34 0 top
C7  27.07,13.36 90 top
C8  24.8,16.3 0 top
C9  29.07,16.36 180 top
C10  25,28 180 top
C11  25,31 180 top
C12  25,34 180 top
C13  11,93.65 270 top
C14  9.17,72.74 270 top
C15  8.01,84 0 top
C16  8,82 0 top
C17  33.26,66.45 90 top
C18  29.77,63.44 0 top
C19  23,64 90 top
C20  25,64 90 top
C21  60.1,72.68 270 top
C22  59,82 0 top
C23  59,84 0 top
C24  62,93.64 270 top
C25  65,35 270 top
C26  67,35 270 top
C27  73.14,24.99 180 top
C28  73.11,27.13 180 top
C29  60.05,23.34 90 top
C30  62.05,23.34 90 top
C31  77,32 0 top
C32  80.73,35 270 top
C33  82.54,35 270 top
D1  29.21,33.03 180 top
D2  15.7,33.02 0 top
D3  6.92,64.34 270 top
D4  57.39,64.44 270 top
D7  72.92,74.83 0 top
J1  70.51,67.56 180 top
J2  1.99,82.01 180 top
J3  52.97,82 180 top
Q1  65.09,58.55 180 top
Q2  12.56,58.51 180 top
Q3  9,68.99 90 top
Q4  60,69 90 top
Q5  68,69 270 top
Q6  79.5,70.83 180 top
Q7  17,68.99 270 top
R1  10k  [0603']  15.37,58.14 270 top
R2  1k  [0603']  21,58.14 270 top
R3  1k  [0603']  18,58.16 270 top
R4  12k  [0603']  31.27,74.16 90 top
R5  10k  [0603']  29,29.5 180 top
R6  10k  [0603']  16,29.49 0 top
R7  10k  [0603']  68,58.44 270 top
R8  4.7k  [0603']  57,76.99 0 top
R9  1k  [0603']  27,58.15 270 top
R10  10k  [0603']  13,70 0 top
R11  10k  [0603']  64,70 0 top
R12  10k  [0603']  64,68 180 top
R13  12k  [0603']  83.18,73.53 90 top
R14  22k  [0603']  63.05,64.49 90 top
R15  4.7k  [0603']  61.1,64.46 270 top
R16  220R  [0603']  79.49,74.35 180 top
R17  4.7k  [0603']  6.14,77.11 0 top
R18  10k  [0603']  13,68 180 top
R19  10k  [0603']  31.26,69.45 180 top
R20  1k  [0603']  24,58.15 270 top
R21  10k  [0603']  9.24,64.08 270 top
R22  10k  [0603']  59.22,64.41 270 top
U1  27,22.5 0 top
U3  18,22.5 0 top
U$1  22.5,3.8 0 top
U$2  3.3,16 90 top
U$3  3.3,29 90 top
U$4  41.7,16 90 top
U$5  41.7,29 90 top
U$6  12,42.95 0 top
U$7  15,42.95 0 top
U$8  18,42.95 0 top
U$9  33,42.95 0 top
U$10  30,42.95 0 top
U$11  27,42.95 0 top
U$12  24,42.95 0 top
U$13  22.5,85.6 0 top
U$14  12,39.95 0 top
U$15  15,39.95 0 top
U$16  18,39.95 0 top
U$17  21,39.95 0 top
U$18  24,39.95 0 top
U$19  27,39.95 0 top
U$20  30,39.95 0 top
U$21  33,39.95 0 top
U$22  21,42.95 0 top
U$23  12.02,53.11 0 top
U$24  15.01,53.11 0 top
U$25  13.69,61.84 0 top
U$26  29.75,66.48 0 top
U$27  20,64 180 top
U$28  3.9,72.8 180 top
U$29  2X2MM_SQUARE_PAD  [2X2MM_SQUARE_PAD']  42.96,80.98 0 top
U$30  2X2MM_SQUARE_PAD  [2X2MM_SQUARE_PAD']  42.95,83.99 0 top
U$31  2X2MM_SQUARE_PAD  [2X2MM_SQUARE_PAD']  42.95,77.99 0 top
U$32  2X2MM_SQUARE_PAD  [2X2MM_SQUARE_PAD']  42.96,74.99 0 top
U$33  2X2MM_SQUARE_PAD  [2X2MM_SQUARE_PAD']  42.96,71.99 0 top
U$34  2X2MM_SQUARE_PAD  [2X2MM_SQUARE_PAD']  42.96,68.99 0 top
U$35  2X2MM_SQUARE_PAD  [2X2MM_SQUARE_PAD']  42.96,65.99 0 top
U$36  2X2MM_SQUARE_PAD  [2X2MM_SQUARE_PAD']  42.95,62.99 0 top
U$37  2X2MM_SQUARE_PAD  [2X2MM_SQUARE_PAD']  23.99,53.04 0 top
U$38  2X2MM_SQUARE_PAD  [2X2MM_SQUARE_PAD']  27,53.04 0 top
U$39  2X2MM_SQUARE_PAD  [2X2MM_SQUARE_PAD']  20.99,53.03 0 top
U$40  2X2MM_SQUARE_PAD  [2X2MM_SQUARE_PAD']  18,53.03 0 top
U$41  2X2MM_SQUARE_PAD  [2X2MM_SQUARE_PAD']  33,53.02 0 top
U$42  2X2MM_SQUARE_PAD  [2X2MM_SQUARE_PAD']  30,53.02 0 top
U$43  2.42,64.87 0 top
U$44  73.5,85.64 0 top
U$45  65,53.02 0 top
U$46  68,53.02 0 top
U$47  66.28,61.89 0 top
U$48  54.92,72.8 180 top
U$49  53.42,64.85 0 top
U$50  2X2MM_SQUARE_PAD  [2X2MM_SQUARE_PAD']  93.95,81.01 0 top
U$51  2X2MM_SQUARE_PAD  [2X2MM_SQUARE_PAD']  93.95,84.01 0 top
U$52  2X2MM_SQUARE_PAD  [2X2MM_SQUARE_PAD']  93.95,78.01 0 top
U$53  2X2MM_SQUARE_PAD  [2X2MM_SQUARE_PAD']  93.95,75.01 0 top
U$54  2X2MM_SQUARE_PAD  [2X2MM_SQUARE_PAD']  93.95,72.01 0 top
U$55  2X2MM_SQUARE_PAD  [2X2MM_SQUARE_PAD']  93.95,69.01 0 top
U$56  2X2MM_SQUARE_PAD  [2X2MM_SQUARE_PAD']  93.95,63.01 0 top
U$57  2X2MM_SQUARE_PAD  [2X2MM_SQUARE_PAD']  93.98,65.99 0 top
U$58  2X2MM_SQUARE_PAD  [2X2MM_SQUARE_PAD']  93.95,78.01 0 bottom
U$59  2X2MM_SQUARE_PAD  [2X2MM_SQUARE_PAD']  93.95,81.01 0 bottom
U$60  2X2MM_SQUARE_PAD  [2X2MM_SQUARE_PAD']  93.95,66.01 0 bottom
U$61  2X2MM_SQUARE_PAD  [2X2MM_SQUARE_PAD']  93.98,68.99 0 bottom
U$62  2X2MM_SQUARE_PAD  [2X2MM_SQUARE_PAD']  93.95,75.01 0 bottom
U$63  2X2MM_SQUARE_PAD  [2X2MM_SQUARE_PAD']  93.95,72.01 0 bottom
U$64  79.55,22 90 top
U$65  2X2MM_SQUARE_PAD  [2X2MM_SQUARE_PAD']  61.99,53.02 0 top
U$66  70,35 0 top
U$67  65.99,42.95 0 top
U$68  69,42.95 0 top
U$69  53.08,24.01 0 bottom
U$70  53.08,21.01 0 top
U$71  2X2MM_SQUARE_PAD  [2X2MM_SQUARE_PAD']  78,42.98 0 top
U$72  2X2MM_SQUARE_PAD  [2X2MM_SQUARE_PAD']  81,42.96 0 top
U$73  2X2MM_SQUARE_PAD  [2X2MM_SQUARE_PAD']  72,42.97 0 top
U$74  2X2MM_SQUARE_PAD  [2X2MM_SQUARE_PAD']  75,42.95 0 top
U$75  77,35 0 top
U$76  54,93 0 top
U$77  54,54 0 top
U$78  93,93 0 top
U$79  93,54 0 top
U$80  72.97,71.37 180 top
U$81  2X2MM_SQUARE_PAD  [2X2MM_SQUARE_PAD']  42.96,74.99 0 bottom
U$82  2X2MM_SQUARE_PAD  [2X2MM_SQUARE_PAD']  42.95,71.99 0 bottom
U$83  2X2MM_SQUARE_PAD  [2X2MM_SQUARE_PAD']  42.96,69 0 bottom
U$84  2X2MM_SQUARE_PAD  [2X2MM_SQUARE_PAD']  42.95,80.99 0 bottom
U$85  2X2MM_SQUARE_PAD  [2X2MM_SQUARE_PAD']  42.95,77.99 0 bottom
U$86  2X2MM_SQUARE_PAD  [2X2MM_SQUARE_PAD']  42.96,65.99 0 bottom

### Tracks (layer width: path | path; a pad name or v marks a point on that pad's centre or on a via)
3.3V
  Top 0.813: U$6.1 12,42.15 10.44,40.6 10.44,39.3 12.34,37.4 12.34,36.73
  Top 1.016: U3.4 18,26.84 C4.1 17.65,29.49 R6.2 17.64,29.49 C5.1 C6.1
  Top 1.27: U$6.1 U$7.1 U$8.1 U$22.1
  Top 2.54: U3.2 U3.4 15.35,25.6 12.34,28.6 12.34,36.73
3.3V_BUS_1  (via drill 0.35)  (1 unrouted)
  Top 0.305: U$28.VDD 7.06,73.8 | 7.06,73.8 8.96,73.8 C14.1 | R17.2 7.06,76.99 7.06,73.8
  Top 0.61: R17.2 8.07,77.11 | U$25.A 15.59,59.16 R1.1
  Top 0.813: R1.1 14.8,59.51 Q2.1 | 8.07,77.11 v8.09,77.13 | v13.69,61.77 15.52,61.77
  Bottom 0.813: v8.09,77.13 8.09,73.09 4.85,69.84 4.85,68.18 5.41,67.61 7.85,67.61 v13.69,61.77
3.3V_BUS_2  (via drill 0.35)  (1 unrouted)
  Top 0.203: 58.08,76.72 58.08,74.05
  Top 0.305: C21.1 59.83,73.8 58.04,73.8 | 58.04,73.8 U$48.VDD | 58.08,74.05 58.04,74.01 58.04,73.8 | R8.2 58.08,76.72
  Top 0.813: U$47.A 66.33,61.89 v66.29,61.85 | v58.93,76.96 57.89,76.96 57.86,77
  Top 1.016: U$47.A 68.18,59.42 | 68.18,59.42 R7.1 | Q1.1 68.05,59.55 68.18,59.42
  Bottom 0.813: v66.29,61.85 60.54,67.6 56.38,67.6 55.83,68.15 55.83,69.81 58.93,72.91 v58.93,76.96
3.3V_EXT_1
  Top 1.27: Q2.3 12.56,53.65 U$23.1
3.3V_EXT_2
  Top 1.016: U$45.1 65,57.36 Q1.3
3.3V_EXT_3  (via drill 0.35)
  Top 0.203: U$75.S1 75.73,32.42 C31.1
  Top 0.254: U$66.VDD 69.71,35.96 69.85,35.81 | U$66.CSB 70.36,35.31 69.85,35.81 | U$66.VDDIO 69.38,34.85 69.55,34.85 69.85,35.15 | 69.85,35.15 69.85,35.81 | 69.85,35.15 69.85,34.67 U$66.SDO 67.14,34.01 C26.2 | U$75.VDD 75.23,35.25 75.18,35.2 75.18,34.95 | U$75.S1 75.66,34.32 75.39,34.32 75.18,34.53 75.18,34.95 | U$75.VDDIO 77.68,36.35 77.68,36.62 76.89,37.41 v76.19,37.41 | v74.41,34.94 75.17,34.94 75.18,34.95
  Top 1.27: 72.26,24.96 C27.2 | 72.26,24.96 C28.2 72.26,29.39 | 72.26,24.96 71.93,24.63 U$64.VCC 71.93,20.62 69.29,17.98 69.29,11.28 71.58,8.99 73.15,8.99 74.47,7.67 U$64.RESET | U$67.1 65.99,39.78 63.2,36.98 63.2,34.14 | 63.2,34.14 63.2,33.38 64.52,32.05 69.6,32.05 72.26,29.39 | 63.2,34.14 63.21,34.15 C25.2 C26.2 | C31.1 74.87,32 72.26,29.39
  Bottom 0.254: v76.19,37.41 74.41,35.63 v74.41,34.94
3.3V_OUT_1  (via drill 0.35)
  Top 0.305: 19.96,63.69 U$27.CSB 19.06,63.52 18.85,63.52 18,62.67 R3.1 | 19.96,63.69 20.44,64.17 20.65,64.17 U$27.VDDIO 20.99,64.51 21.19,64.51 21.53,64.85 C19.2 C20.2 | U$27.VDD 20.61,63.04 19.96,63.69 | U$26.VDDIO 29.25,63.77 C18.1 28.92,60.87 | C17.1 33.08,65.78 32.06,65.78 | 32.06,65.78 U$26.VDD | R19.1 32.06,65.78 | R9.1 28.92,60.87 | R19.1 32.78,69.45 34.61,67.62 34.61,64.94 30.54,60.87 28.92,60.87 | R4.1 32.06,72.57 R19.1 | R21.2 11.64,63.28 11.79,63.13
  Top 0.61: U$25.K 11.79,63.13 11.79,63.49 v11.79,65.93 v11.78,65.94 | v11.85,72.64 11.85,75.54 11.07,76.32 11.07,91.31 10.12,92.26 10.12,93.34 10.39,93.61 11.61,93.61 12,93.22 U$13.3.3V
  Top 0.813: R3.1 20.98,58.96 R2.1 R20.1 R9.1 | U$25.K 11.61,61.66 Q2.2
  Bottom 0.61: v11.78,65.94 11.78,72.57 v11.85,72.64
  pour Top: 0.76,95.2 0.76,51.8 44.24,51.8 44.24,95.2
3.3V_OUT_2  (via drill 0.35)
  Top 0.305: J1.VCC 75.75,57.05 75.75,57.74 71.29,62.21 | 64.38,64.77 66.25,62.9 70.6,62.9 71.29,62.21 | R22.2 59.96,64.35 64.38,64.35 | Q6.C 77.94,68.17 77.23,68.17 77.06,67.99 77.06,67.97 71.29,62.21
  Top 0.406: R13.1 82.96,72.51 82.96,72.43 80.26,69.73 Q6.C
  Top 0.61: U$47.K 64.38,64.35 64.38,64.77 64.38,65.72 v64.43,65.77 | v62.65,71.83 62.65,74.77 61.69,75.73 61.69,76.42 60.66,77.46 60.66,87.08 60.78,87.29 61.19,87.7 61.19,92.18 61.12,92.25 61.12,93.33 61.39,93.6 62.61,93.6 62.95,93.26 U$44.3.3V
  Top 1.016: Q1.2 64.14,61.65 U$47.K
  Bottom 0.61: v64.43,65.77 62.65,67.55 v62.65,71.83
  pour Top: 51.77,95.22 51.77,51.8 95.3,51.8 95.3,95.22
5V
  Top 0.813: U$9.1 33,42.15 34.56,40.6 34.56,39.3 33.86,38.61 33.86,36.88
  Top 1.016: U1.4 27,26.85 C10.1 27.35,29.5 | 27.35,29.5 C11.1 C12.1 | 27.35,29.5 R5.2
  Top 1.27: U$12.1 U$11.1 U$10.1 U$9.1
  Top 2.54: U1.2 U1.4 29.77,25.6 33.86,29.7 33.86,36.88
BAT_BCKP
  Top 1.27: U$64.V_BCKP 69.39,23.17 68.38,24.18 62.06,24.18 C30.2 C29.2 53.26,24.19 U$69.1
BUZ_PIN
  Top 0.305: R16.2 79.22,74.88 U$44.IO-2
D+_1
  Top 0.203: U$28.D+ 8.32,72.8 8.49,72.63 9.85,72.63 10.21,72.99 10.21,77.97 8.12,80.05 8.12,84.68 7.76,85.03 4.63,85.03 3.33,83.74 3.33,82.73 3.83,82.23 4.42,82.23 J2.D+
D+_2
  Top 0.203: U$48.D+ 59.2,72.8 59.42,72.57 60.78,72.57 61.13,72.93 61.13,76.19 59.11,78.22 59.11,84.68 58.75,85.03 55.62,85.03 54.31,83.73 54.31,82.72 54.81,82.22 55.4,82.22 J3.D+
D-_1
  Top 0.203: J2.D- 4.55,82.75 3.96,82.75 3.69,83.03 3.69,83.59 4.78,84.68 7.62,84.68 7.76,84.53 7.76,79.91 9.85,77.82 9.85,73.14 9.7,72.99 8.64,72.99 8.33,73.3 U$28.D-
D-_2
  Top 0.203: J3.D- 55.53,82.74 54.95,82.74 54.67,83.02 54.67,83.58 55.77,84.68 58.6,84.68 58.75,84.53 58.75,78.07 60.78,76.05 60.78,73.08 60.63,72.93 59.57,72.93 59.2,73.3 U$48.D-
DTR_1
  Top 0.305: Q7.E 15.86,68 R18.1 13.8,68.79 13.14,69.45 13.14,70.26 12.86,70.55 12.68,70.73 9.46,70.73 9.13,70.4 U$28.DTR
DTR_2
  Top 0.305: U$48.DTR 60.12,70.4 60.45,70.73 63.51,70.73 63.68,70.73 64.14,70.26 64.14,69.45 64.8,68.79 R12.1
  Top 0.406: Q5.E 64.85,68.05 R12.1
EN_1
  Top 0.203: Q3.C 12.34,68.99 12.8,68.53 12.8,67.86 13.35,67.32 16.54,67.32 16.75,67.53 16.75,71.42 11.63,76.55 11.63,92.17 C13.2
  Top 0.406: C13.2 11.85,91.95 U$13.EN
EN_2
  Top 0.305: Q4.C 63.41,69 64.14,68.26 64.14,67.45 64.32,67.27 67.55,67.27 67.81,67.52 67.81,70.48 62.3,75.98 62.3,76.68 61.27,77.71 61.27,86.91 61.27,86.92 61.8,87.45 61.8,92.59 C24.2
  Top 0.406: C24.2 62.8,91.99 U$44.EN
EXT_V
  Top 0.305: U$65.1 61.99,60.43 63.05,61.48 R14.1
GND  (via drill 0.35, 0.35 pad 0.5)
  Top 0.203: U$75.GND1 78.17,35.15 77.94,35.15 77.79,35.01 77.79,34.49 78.04,34.25 U$75.GND 80.63,34.25 C32.2 v80.73,33.08 v80.72,33.07 | C14.2 8.79,72.28 8.35,72.28 8.32,72.3 U$28.GND | U$66.GND 70.25,35.96 70,36.2 70,37 | C31.2 77.85,30.85 74.13,27.13 C28.1
  Top 0.254: U$44.GND@3 72,88.14 | 72,88.14 v72.03,88.14 72.07,88.14 U$44.GND@4 | U$44.GND@11 73.56,86.58 | 73.56,86.58 v73.56,86.61 | U$44.GND@5 73.6,88.14 | 73.6,88.14 v73.56,88.14 73.53,88.14 | U$44.GND@9 U$44.GND@10 | U$44.GND@6 U$44.GND@9 | U$44.GND@6 U$44.GND@3 | U$44.GND@7 U$44.GND@6 | U$44.GND@7 U$44.GND@10 | U$44.GND@8 U$44.GND@11 | U$44.GND@8 U$44.GND@7 | U$44.GND@10 U$44.GND@11 | U$44.GND@4 U$44.GND@5 | U$44.GND@4 U$44.GND@3 | U$44.GND@4 U$44.GND@7 | U$44.GND@9 72.03,86.57 72.03,86.58 | 72.03,86.58 v72.03,86.61 | U$44.GND@5 U$44.GND@8 | U$13.GND@9 21.03,86.53 | 21.03,86.53 v21.03,86.56 | U$13.GND@11 22.59,86.51 | 22.59,86.51 v22.55,86.51 22.54,86.51 | U$13.GND@5 22.55,88.06 | 22.55,88.06 v22.55,88.04 | U$13.GND@3 21.01,88.09 | 21.01,88.09 v21.03,88.09 | U$13.GND@3 20.27,87.63 | 20.27,87.63 U$13.GND@6 | U$13.GND@6 U$13.GND@9 | U$13.GND@9 U$13.GND@10 | U$13.GND@10 U$13.GND@11 | U$13.GND@8 U$13.GND@11 | U$13.GND@8 U$13.GND@5 | U$13.GND@5 U$13.GND@4 | U$13.GND@4 U$13.GND@7 | U$13.GND@7 U$13.GND@8 | U$13.GND@7 20.61,87.3 20.27,87.63 | U$13.GND@7 U$13.GND@10 | U$13.GND@3 U$13.GND@4 | U$28.GND1 3.1,73.6 v3.1,73.66 | U$28.GND1 4.72,73.62 v4.72,73.66 | U$28.GND1 4.7,72 4.77,71.93 v4.78,71.93 | U$28.GND1 3.05,71.95 v3.05,71.93 | U$48.GND1 v54.01,73.71 v54,73.71 | U$48.GND1 v55.83,73.71 | U$48.GND1 v54,71.88 | U$48.GND1 55.6,72.11 55.83,71.89 v55.83,71.88 | U$13.GND@6 21.01,88.04 | 21.01,88.04 21.01,88.09 | U$13.GND@7 21.06,88.04 21.01,88.04 | U$13.GND@4 21.01,88.04 | U$13.GND@7 22.55,88.06 | U$13.GND@4 22.55,88.07 22.55,88.06 | U$13.GND@8 22.55,88.06 | U$13.GND@10 22.54,86.51 | U$13.GND@7 22.59,86.51 | U$13.GND@8 22.54,86.51 | U$13.GND@6 20.27,87.29 21.03,86.53 | U$13.GND@7 21.03,86.53
  Top 0.254: U$13.GND@10 21.79,85.78 21.03,86.53 | U$44.GND@6 72,88.07 72,88.14 | U$44.GND@7 72,88.14 | U$44.GND@4 73.53,88.14 | U$44.GND@7 73.53,88.07 73.53,88.14 | U$44.GND@8 73.6,88.07 73.6,88.14 | U$44.GND@10 73.56,86.57 73.56,86.58 | U$44.GND@7 73.56,86.58 | U$44.GND@8 73.57,86.58 73.56,86.58 | U$44.GND@6 72.03,86.58 | U$44.GND@10 72.03,86.58 | U$44.GND@7 72.04,86.58 72.03,86.58
  Top 0.305: C19.1 C20.1 25.73,63.88 25.73,65.33 25.7,65.36 25.7,65.55 21.59,65.55 | C19.1 22.46,63.69 U$27.GND@1 | U$27.GND 19.96,63.04 20.44,62.56 22.41,62.56 C19.1 | U$26.GND U$26.GND_ | U$26.GND_ 29.35,66.28 U$26.SCX U$26.SDX U$26.SA0 | C18.2 30.25,63.81 U$26.GND_ | C17.2 33.26,66.81 33.99,66.08 33.99,65.12 33.81,64.94 32.12,64.94 C18.2 | C18.2 30.62,62.64 v29.97,61.99 | U$27.SDO 21.37,65.55 21.59,65.55 | 21.59,65.55 21.5,65.64 v21.5,66.11 | 55.6,72.11 55.79,72.3 U$48.GND 57.39,72.23 57.9,72.23 58.29,71.83 C21.2 | U$49.2 54.12,64.15 | 54.12,64.15 v54.1,64.14 | J1.GND 73.95,55.15 | J1.GND3 72.81,54.01 73.95,55.15 | J1.GND1 76.09,53.01 73.95,55.15 | U$80.- 72.03,74.83 D7.A | R15.2 60.28,62.84 56.54,62.84 55.85,62.15 54.38,62.15 54.34,62.11 54.12,62.33 54.12,64.15
  Top 0.406: U$13.GND@2 29.89,94.49 v29.87,94.51 | v15.27,94.49 U$13.GND C13.1 | U$13.GND@1 16.79,78.17 v16.77,78.18 | U$28.GND 4.99,72.3 4.7,72 | U$43.2 v2.93,64.17 v2.92,64.18 | J2.GND 5.25,80.71 v5.88,80.08 | C15.2 8.94,83.92 v8.94,83 8.94,82.09 C16.2 | v66.08,94.52 v66.07,94.53 U$44.GND 64.57,94.49 C24.1 | U$44.GND@2 v80.74,94.53 | v67.79,78.22 v67.78,78.22 U$44.GND@1 67.78,76.16 U$80.-
  Top 0.508: D1.C 28.34,34.28 v28.35,34.29 | D2.C 16.58,34.27 v16.56,34.29 | U$3.MOT- 1.39,33.41 v1.39,33.73 | U$3.MOT- 2.18,32.62 v2.18,33.73 | U$3.MOT- 3,31.8 v3,33.73 | U$3.MOT- 3.81,32.01 v3.81,33.68 | U$3.MOT- 4.62,32.82 v4.62,33.68 | U$5.MOT- 43.61,33.41 v43.61,33.83 | U$5.MOT- 42.77,32.57 v42.77,33.83 | U$5.MOT- 41.96,31.76 v41.96,33.83 | U$5.MOT- 41.15,32.05 v41.15,33.83 | U$5.MOT- 40.34,32.87 v40.34,33.83 | U$2.MOT- 1.39,20.41 v1.39,20.73 | U$2.MOT- 2.23,19.57 v2.23,20.73 | U$2.MOT- 3.05,18.75 v3.05,20.73 | U$2.MOT- 3.86,19.06 v3.86,20.73 | U$2.MOT- 4.67,19.87 v4.67,20.73 | U$4.MOT- 43.54,20.34 v43.54,20.73 | U$4.MOT- 42.72,19.52 v42.72,20.73 | U$4.MOT- 41.91,18.71 v41.91,20.73 | U$4.MOT- 41.1,19.1 v41.1,20.73 | U$4.MOT- 40.23,19.97 v40.23,20.73 | J3.GND 56.21,80.7 v57.02,79.88 | J1.GND3 69.97,53.02 U$46.1
  Top 0.61: C23.2 59.85,83.04 | 59.85,83.04 v59.82,83.01 | C22.2 59.85,83.04
  Top 0.813: U$1.BAT- 17.04,2.34 | 17.04,2.34 v15.24,2.34 | U$1.BAT- 17.95,3.25 v15.29,3.25 | U$1.BAT- 18.13,4.17 v15.29,4.17 | U$1.BAT- 17.22,5.08 v15.29,5.08 | U$1.BAT- 16.25,6.04 v15.29,6.04 | v15.24,1.44 16.14,1.44 17.04,2.34
  Top 1.016: C4.2 v22.5,27.99 | v22.5,27.99 | C10.2 v22.5,27.99 | C5.2 v22.49,31 | v22.49,31 v22.5,30.99 | C11.2 v22.49,31 | C6.2 v22.49,34 | v22.49,34 v22.5,33.98 | C12.2 v22.49,34 | U3.1 v14.08,19.4 v14.07,19.41 | C2.2 18.79,16.35 v18.03,15.6 | C1.2 17.3,16.32 v18.03,15.6 | C3.2 v18.03,15.59 v18.03,15.6 | C9.2 27.79,16.36 v27.03,15.6 | C8.2 26.32,16.3 v27.03,15.6 | C7.2 27.03,14.25 v27.03,15.6 | U1.1 v23.22,19.4 v23.22,19.41 | U$46.1 R7.2
  Top 1.27: R1.2 15.37,53.47 U$24.1
  Bottom 0.203: v80.72,33.07 80.79,33 85,33
  other vias: 3.9,72.8 54.92,72.8
  pour Bottom: -3,98 -3,-2 99,-2 99,44.17 84,44.17 84,29 70,29 70,45.58 99,45.58 99,98
  pour Top: 51.74,44.23 51.74,0.76 95.28,0.76 95.28,44.19 84,44.19 84,29 70,29 70,44.23
GPIO_2  (via drill 0.35)
  Top 0.305: U$13.IO-2 28.03,76.89 v28.03,79.39
  Bottom 0.305: v28.03,79.39 29.66,79.39 42.96,66.09 U$86.1
GPIO_25  (via drill 0.35)
  Top 0.305: U$13.IO-25 v28.1,83.06 v28.11,83.05
  Bottom 0.305: v28.11,83.05 29.45,83.05 37.51,74.99 U$81.1
GPIO_26  (via drill 0.35)
  Top 0.305: U$13.IO-26 v28.02,81.79 v28.03,81.78
  Bottom 0.305: v28.03,81.78 29.51,80.3 31.07,80.3 39.38,71.99 U$82.1
GPIO_27  (via drill 0.35)
  Top 0.305: U$13.IO-27 28.01,80.52 v28.03,80.54
  Bottom 0.305: v28.03,80.54 28.72,79.85 30.4,79.85 41.25,69 U$83.1
GPIO_34  (via drill 0.35)
  Top 0.305: U$13.IO-34 14.58,88.14 18.02,84.7 v28.11,84.7
  Bottom 0.305: v28.11,84.7 29.86,84.7 33.57,80.99 U$84.1
GPIO_35  (via drill 0.35)
  Top 0.305: U$13.IO-35 15.2,86.87 17.83,84.24 27.27,84.24 v27.5,84.02
  Bottom 0.305: v27.5,84.02 27.78,83.73 29.72,83.73 35.47,77.99 U$85.1
GPS_RX
  Top 0.406: U$72.1 81,40.77 84.53,37.24 84.53,32.51 79.55,27.53 U$64.RXD1
GPS_SCL
  Top 0.254: U$74.1 72.41,40.36 72.41,35.76 | U$66.SCK 70.97,34.2 71.14,34.2 72.41,35.47 72.41,35.76 | U$75.SCL 72.42,35.75 72.41,35.76
GPS_SDA  (via drill 0.35)
  Top 0.254: U$66.SDI 70.97,34.85 71.14,34.85 72,35.71 72,37.59 | U$73.1 72,37.59 | U$75.SDA 74.99,37.54 v73.06,37.54 | v71.37,37.54 71.42,37.59 72,37.59
  Bottom 0.254: v73.06,37.54 v71.37,37.54
GPS_TX
  Top 0.406: U$71.1 83.97,37.01 83.97,32.77 76.96,25.76 76.96,22.05 U$64.TXD1
IO-0_1  (via drill 0.35)
  Top 0.203: U$43.3 13.03,67.07 13.25,66.84 16.62,66.84 17.36,67.58 17.36,68.25 Q7.C
  Top 0.305: Q7.C 23.28,68.99 v28.28,73.99 | v30.48,76.21 31.38,76.21 31.39,76.2
  Top 0.813: R4.2 31.39,75.08 31.39,75.64 31.39,76.2 U$13.IO-0
  Bottom 0.305: v28.28,73.99 30.48,76.19 v30.48,76.21
IO-0_2
  Top 0.203: U$49.3 63.97,67.05 64.16,66.86 67.72,66.86 68.21,67.36 68.21,68.11 Q5.C 72.95,69 74.53,70.58 80.46,70.58 80.95,71.08 82.5,72.62 82.5,73.19 83.18,73.86 R13.2 83.17,77.24 U$44.IO-0
M_SIG_LB  (via drill 0.35)
  Top 0.406: v56.13,53.85 54.15,53.85 U$77.1 | U$44.IO-27 64.15,80.1 63.71,80.1 63.05,79.43 63.05,76.48 v64.63,74.9
  Bottom 0.406: v56.13,53.85 59.37,53.85 67.06,61.53 67.06,64.18 64.63,66.61 v64.63,74.9
M_SIG_LT  (via drill 0.35)
  Top 0.406: v55.74,93.12 54.12,93.12 U$76.1 | U$44.IO-35 64.39,86.69 63.56,86.69 62.46,87.79 62.46,88.44 62.48,88.47 v62.48,90.91
  Bottom 0.406: v62.48,90.91 60.27,93.12 v55.74,93.12
M_SIG_RB  (via drill 0.35)
  Top 0.406: U$44.IO-26 70.21,81.83 72.52,79.52 77.45,79.52 78.46,79.52 v78.48,79.54 | v92.83,55.56 92.83,54.17 U$79.1
  Bottom 0.406: v78.48,79.54 78.48,72.58 92.83,58.23 v92.83,55.56
M_SIG_RT  (via drill 0.35)
  Top 0.406: v91.2,93.15 92.85,93.15 U$78.1 | U$44.IO-25 63.27,83.1 v63.22,83.15
  Bottom 0.406: v63.22,83.15 73.22,93.15 v91.2,93.15
MISO_1
  Top 0.305: U$13.IO-19 35.13,85.6 39.75,80.98 U$29.1
MISO_2  (via drill 0.35)
  Top 0.305: U$13.IO-12 18.15,73.44 v19.69,73.44 | v34.42,72.18 42.77,72.18 U$33.1
  Bottom 0.305: v19.69,73.44 27.78,73.44 28,73.22 33.38,73.22 v34.42,72.18
MISO_3  (via drill 0.35)
  Top 0.305: U$50.1 87.38,81.01 83.27,85.12 82.91,85.12 U$44.IO-19 v80.8,85.64 | J1.DO/DAT0 72.45,57.26 72.45,57.74 70.25,59.94 v70.25,61.72
  Bottom 0.305: v70.25,61.72 70.25,79.54 76.36,85.64 v80.8,85.64
MISO_4  (via drill 0.35)
  Top 0.305: U$44.IO-12 64.95,78.36 66.96,78.36 67.51,78.9 68.07,78.9 68.12,78.86 v80.62,78.86 | v92.42,71.92 93.86,71.92 U$54.1
  Bottom 0.305: v80.62,78.86 84.22,78.86 91.16,71.92 91.75,71.92 v92.42,71.92
MOSI_1
  Top 0.305: U$13.IO-23 31.75,93.22 32.9,92.07 32.9,89.14 38.05,83.99 U$30.1
MOSI_2  (via drill 0.35)
  Top 0.305: U$13.IO-13 18.34,76.42 18.34,75.73 19.95,74.12 19.97,74.12 21.38,72.72 v21.43,72.72 | v36.41,69.22 36.64,68.99 U$34.1
  Bottom 0.305: v21.43,72.72 32.91,72.72 v36.41,69.22
MOSI_3  (via drill 0.35)
  Top 0.305: U$51.1 88.69,84.01 85.37,87.33 85.37,90.64 83.27,92.75 82.91,92.75 U$44.IO-23 81.42,93.26 77.42,89.26 v77.42,84.24 | J1.DI/CMD 76.86,57.26 76.86,57.54 72.58,61.81 v72.58,62.25
  Bottom 0.305: v72.58,62.25 71.9,62.93 71.9,78.72 v77.42,84.24
MOSI_4  (via drill 0.35)
  Top 0.305: U$44.IO-13 69.25,76.94 69.25,77.72 69.9,78.37 79.9,78.37 81.62,76.65 v82.26,76.65 | v92.36,69.03 93.93,69.03 U$55.1
  Bottom 0.305: v82.26,76.65 84.24,76.65 91.86,69.03 v92.36,69.03
N$1
  Top 0.508: D1.A 30.09,29.79 R5.1
N$2
  Top 0.508: D2.A 14.83,29.86 R6.1
N$3
  Top 0.305: R8.1 55.92,76.71 U$48.RST-
N$4
  Top 0.406: R11.2 66.85,70 Q5.B
N$5
  Top 0.406: R12.2 61.15,68 Q4.B
N$6
  Top 0.305: D3.A 8.9,65.22 R21.1
N$7
  Top 0.305: D4.A 59.11,65.32 R22.1
N$8
  Top 0.305: D3.C 6.13,62.67 U$43.1
N$9
  Top 0.305: D4.C 57.12,63.3 56.35,63.3 55.7,62.65 U$49.1
N$10
  Top 0.305: R16.1 80.29,72.09 Q6.B
N$11
  Top 0.203: R17.1 4.9,76.67 U$28.RST-
N$12
  Top 0.305: Q6.E 77.21,73.27 U$80.+ 75.18,73.27 D7.C
N$13
  Top 0.305: Q3.B 12.16,68.04 R18.2
N$14  (via drill 3.2)
  other vias: 7.25,7.26
N$15
  Top 0.305: R19.2 30.25,69.24 U$26.CS
N$17
  Top 0.305: R10.2 15.84,70 Q7.B
N$22
  Top 0.203: U$75.SETP 79.18,33.72 80.46,32.44 80.98,32.44 81.35,32.81 81.35,32.96 C33.2
N$24  (via drill 3.2)
  other vias: 7.25,88.75
N$26
  Top 0.203: U$75.C1 78.32,34.8 78.55,34.8 79.6,35.85 C32.1
N$27
  Top 0.203: U$75.SETC 79.05,36.52 82.04,36.52 82.54,36.03 C33.1
N$30  (via drill 3.2)
  other vias: 88.75,88.76
N$32  (via drill 3.2)
  other vias: 88.74,7.26
RTS_1
  Top 0.305: R10.1 12.14,69.94 Q3.E 7.42,69.94 6.48,69 6.48,68.27 6.08,67.87 5.13,67.87 3.44,69.56 3.44,70.36 U$28.RTS
RTS_2
  Top 0.305: U$48.RTS 54.46,70.36 54.46,69.47 56.07,67.86 57.05,67.86 57.45,68.25 57.45,68.98 58.41,69.94 60.31,69.94 60.32,69.95 Q4.E
  Top 0.406: Q4.E 63.15,69.95 R11.1
RX_1  (via drill 0.35)
  Top 0.305: U$28.TXD 4.47,70.33 4.47,69.82 4.84,69.46 v5.78,69.46 | v29.89,89.37 31.35,89.37 U$13.RXD0
  Bottom 0.305: v5.78,69.46 15.99,79.67 19.18,79.67 28.88,89.37 v29.89,89.37
RX_2
  Top 0.305: U$13.IO-16 31.43,80.48 33.02,80.48 33.02,70.11 35.3,67.83 35.3,60.45 30,55.15 U$42.1
RX_3  (via drill 0.35)
  Top 0.305: U$48.TXD 55.42,69.8 55.78,69.45 v56.79,69.45 | v80.9,89.41 82.35,89.41 U$44.RXD0
  Bottom 0.305: v56.79,69.45 71.71,84.37 73.59,84.37 75.78,86.56 76.96,86.56 79.09,88.69 79.09,89.01 79.49,89.41 v80.9,89.41
RX_4  (via drill 0.35)
  Top 0.305: U$44.IO-16 83.83,80.56 v83.85,80.54
  Bottom 0.305: v83.85,80.54 91.76,72.63 93.33,72.63 U$63.1
S1  (via drill 3.2)
  Top 0.61: v7.24,37.76 v7.24,58.26
S2  (via drill 3.2)
  Top 0.61: 48,58.25 v58.24,58.25 v58.24,37.76 | 48,58.25 v37.75,58.25 v37.75,37.75 38.5,37 46,37 48,35 48,11 | v58.25,7.26 51.74,7.26 48,11 | v37.75,7.26 44.26,7.26 48,11 | v58.25,88.74 49.24,88.74 48,87.5 | 48,58.25 48,87.5 | v37.75,88.76 46.74,88.76 48,87.5
S3  (via drill 3.2)
  Top 0.61: v88.74,58.25 v88.74,37.77 v88.75,37.76
SCL_1  (via drill 0.35, 0.35 pad 0.5)
  Top 0.305: U$13.IO-22 30.88,91.44 29.91,91.44 29.16,90.69 v29.16,87.59 | v29.86,85.66 29.86,76.64 29.55,76.33 29.55,71.12 | 29.55,71.12 29.55,68.37 29.71,68.22 29.71,67.72 U$26.SCL | 29.55,71.12 30.45,71.12 v30.48,71.15 | v28.51,57.12 27,55.61 27,55.15
  Top 1.27: R9.2 27,55.15 U$38.1
  Bottom 0.305: v29.16,87.59 29.16,86.36 v29.86,85.66 | v30.48,71.15 30.48,63.24 30.65,63.07 30.65,59.26 v28.51,57.12
SCL_2  (via drill 0.35)
  Top 0.305: U$13.IO-32 13.1,85.08 12.73,85.08 12.1,84.45 12.1,76.8 v18.38,70.52 | U$27.SCK 19.23,65.14 v18.48,65.89 16.81,64.22 16.81,58.29 17.32,57.79 17.57,57.79 R3.2
  Top 0.61: R3.2 U$40.1
  Bottom 0.305: v18.38,70.52 18.38,65.99 v18.48,65.89
SCL_3  (via drill 0.35)
  Top 0.305: U$44.IO-22 82.66,91.72 83.33,91.72 83.96,91.09 v83.96,90.79
  Bottom 0.305: v83.96,90.79 83.98,90.77 83.98,89.6 92.58,81.01 U$59.1
SCL_4  (via drill 0.35)
  Top 0.305: v79.44,81.33 75.03,84.2 70.42,84.2 68.98,85.64 U$44.IO-32
  Bottom 0.305: v79.44,81.33 79.93,80.84 79.93,78.48 80.4,78.01 83.82,78.01 91.7,70.13 92.84,70.13 U$61.1
SD_CS  (via drill 0.35)
  Top 0.305: v78.47,58.76 78.47,57.38 J1.CS/DAT3 | v78.54,82.86 78.78,83.1 U$44.IO-5
  Bottom 0.305: v78.47,58.76 78.54,58.83 78.54,71.8 77.8,72.55 77.8,79.83 78.54,80.57 v78.54,82.86
SDA_1  (via drill 0.35, 0.35 pad 0.5)
  Top 0.305: U$13.IO-21 30.88,87.62 30.51,87.62 28.97,86.08 28.97,71.12 | U$26.SDA 28.97,67.96 28.97,71.12 | 28.97,71.12 27.46,69.61 27.46,61.49 v27.43,61.49 | v25.41,57.2 24,55.79 24,55.56
  Top 1.27: R20.2 24,55.56 U$37.1
  Bottom 0.305: v27.43,61.49 25.41,59.47 v25.41,57.2
SDA_2  (via drill 0.35)
  Top 0.305: U$13.IO-33 13.1,83.81 12.73,83.81 12.55,83.64 12.55,77.31 v17.66,72.2 | U$27.SDI 18.47,64.34 v18.31,64.5 18.31,63.63 17.27,62.59 17.27,58.48 17.5,58.25 20.09,58.25 R2.2
  Top 1.27: R2.2 U$39.1
  Bottom 0.305: v17.66,72.2 17.66,65.15 v18.31,64.5
SDA_3  (via drill 0.35)
  Top 0.305: U$44.IO-21 83.56,88.18 v83.99,87.75 v84,87.75
  Bottom 0.305: v84,87.75 93.74,78.01 U$58.1
SDA_4  (via drill 0.35)
  Top 0.305: U$44.IO-33 65.12,83.86 69.16,83.86 72.79,80.23 v79.22,80.23
  Bottom 0.305: U$60.1 93.44,66.01 83.49,75.97 81.8,75.97 79.47,78.29 79.47,79.98 v79.22,80.23
SPI_CLK_1
  Top 0.305: U$31.1 41.16,77.99 34.82,84.33 U$13.IO-18
SPI_CLK_2  (via drill 0.35)
  Top 0.305: U$13.IO-14 v26.41,79.25 v26.42,79.26 | v40.66,67.32 41.99,65.99 U$35.1
  Bottom 0.305: v26.42,79.26 27.19,79.26 27.75,78.71 29.28,78.71 v40.66,67.32
SPI_CLK_3  (via drill 0.35)
  Top 0.305: U$52.1 89.11,78.01 83.27,83.86 82.91,83.86 U$44.IO-18 v80.81,84.37 | J1.SCLK 74.66,57.26 74.66,57.54 74.48,57.72 74.47,57.72 v71.2,60.98
  Bottom 0.305: v71.2,60.98 71.2,79.22 77.03,85.05 80.13,85.05 v80.81,84.37
SPI_CLK_4  (via drill 0.35)
  Top 0.305: U$44.IO-14 64.32,79 63.96,79 63.55,78.6 63.55,77.44 70.82,70.18 v72.8,70.18 | U$56.1 91.53,65.43 v77.6,65.43
  Bottom 0.305: v72.8,70.18 77.55,65.43 v77.6,65.43
SPI_CS_1
  Top 0.305: U$32.1 42.09,74.99 34.02,83.06 U$13.IO-5
SPI_CS_2  (via drill 0.35)
  Top 0.305: U$13.IO-15 26.78,76.55 26.78,75.58 24.53,73.33 v24.53,71.97 | v37.89,65.03 39.93,62.99 U$36.1
  Bottom 0.305: v24.53,71.97 30.95,71.97 v37.89,65.03
SPI_CS_3
  Top 0.305: U$44.IO-4 84.45,79.29 86.19,77.55 89.4,77.55 91.94,75.01 U$53.1
SPI_CS_4  (via drill 0.35)  (1 unrouted)
  Top 0.305: U$44.IO-15 77.94,77.47 78.38,77.91 79.69,77.91 79.97,77.63 79.97,76.69 81.78,74.88 v81.78,74.83 | v92.42,66.01 93.96,66.01
  Bottom 0.305: v81.78,74.83 83.6,74.83 v92.42,66.01
TX_1  (via drill 0.35)
  Top 0.305: U$28.RXD 3.94,70.36 3.94,69.7 5.1,68.55 v5.8,68.55 | v30.06,90.62 30.12,90.68 U$13.TXD0
  Bottom 0.305: v30.06,90.62 30.06,90.17 30.57,89.65 30.57,89.09 29.76,88.27 28.88,88.27 19.47,78.87 16.16,78.87 6.07,68.77 6.03,68.77 v5.8,68.55
TX_2
  Top 0.305: U$13.IO-17 33,81.79 33.48,81.31 33.48,70.39 35.83,68.04 35.83,60.33 33,57.5 U$41.1
TX_3  (via drill 0.35)
  Top 0.305: v56.77,68.54 56.04,68.54 54.92,69.66 U$48.RXD | v79.77,88.72 80.22,89.17 80.22,89.69 81.25,90.72 U$44.TXD0
  Bottom 0.305: v56.77,68.54 56.99,68.76 57.08,68.76 72.22,83.91 73.78,83.91 75.97,86.1 77.14,86.1 v79.77,88.72
TX_4  (via drill 0.35)
  Top 0.305: U$44.IO-17 82.91,81.31 84.04,81.31 85.11,80.25 v85.12,80.25
  Bottom 0.305: v85.12,80.25 90.36,75.01 U$62.1
V_BATT
  pour Top: 0.67,44.42 0.67,0.63 44.37,0.63 44.37,44.42
V_SENS  (via drill 0.35)
  Top 0.305: R14.2 63.02,65.26 R15.1 60.22,66.15 v60.22,66.31 | v63.19,88.14 63.23,88.18 U$44.IO-34
  Bottom 0.305: v63.19,88.14 53.32,78.27 53.32,69.66 56.14,66.84 59.69,66.84 v60.22,66.31
VBUS_1
  Top 0.305: U$28.VBUS 5.4,75.31 6.14,76.05 6.14,74.46 U$28.REGIN
  Top 0.508: 6.14,76.05 6.14,78.97 6.78,79.61 6.78,81.62 C16.1
  Top 0.61: J2.VBUS 6.47,83.31 | 6.47,83.31 C15.1 | C16.1 7.15,82.63 6.47,83.31
VBUS_2
  Top 0.305: U$48.VBUS 56.42,75.47 57.02,76.07 57.02,74.6 U$48.REGIN
  Top 0.508: C22.1 58.15,78.69 57.04,77.59 57.04,76.09 57.02,76.07
  Top 0.61: J3.VBUS 57.45,83.3 | 57.45,83.3 C23.1 | C22.1 58.15,82.6 57.45,83.3

### Text on the board
tPlace: S35 | S25 | MOSI23 | MOSI23 | MISO19 | MISO19 | CLK18 | CLK18 | CS5 | CS4 | Z | Y | MISO12 | MISO12 | 0x6A | MOSI13 | MOSI13 | X | CLK14 | CS15 | Micro SD | CS15 | CLK14 | 0x76 | SPI | S27 | S26 | V_SEN | 3.3V | GND | 3.3V | GND | SCL2 | SDA2 | SDA1 | SCL1 | RX2 | TX2 | JLCJLCJLCJLC | 3.3V | GND | SDA | SCL | TX | RX | 3.3V | 5V | 0x0D | GND | GND | 0x77 | - | - | Y | + | + | X | Z | BAT+ | 5V | 3V3 | BAT- | - | - | + | +
bPlace: 34 | SCL22 | 35 | SDA21 | 25 | TX17 | 26 | RX16 | 27 | SCL32 | 2 | SDA33